# EAGLE board debug_backplane (EAGLE 8.3.1), part 1 of 3
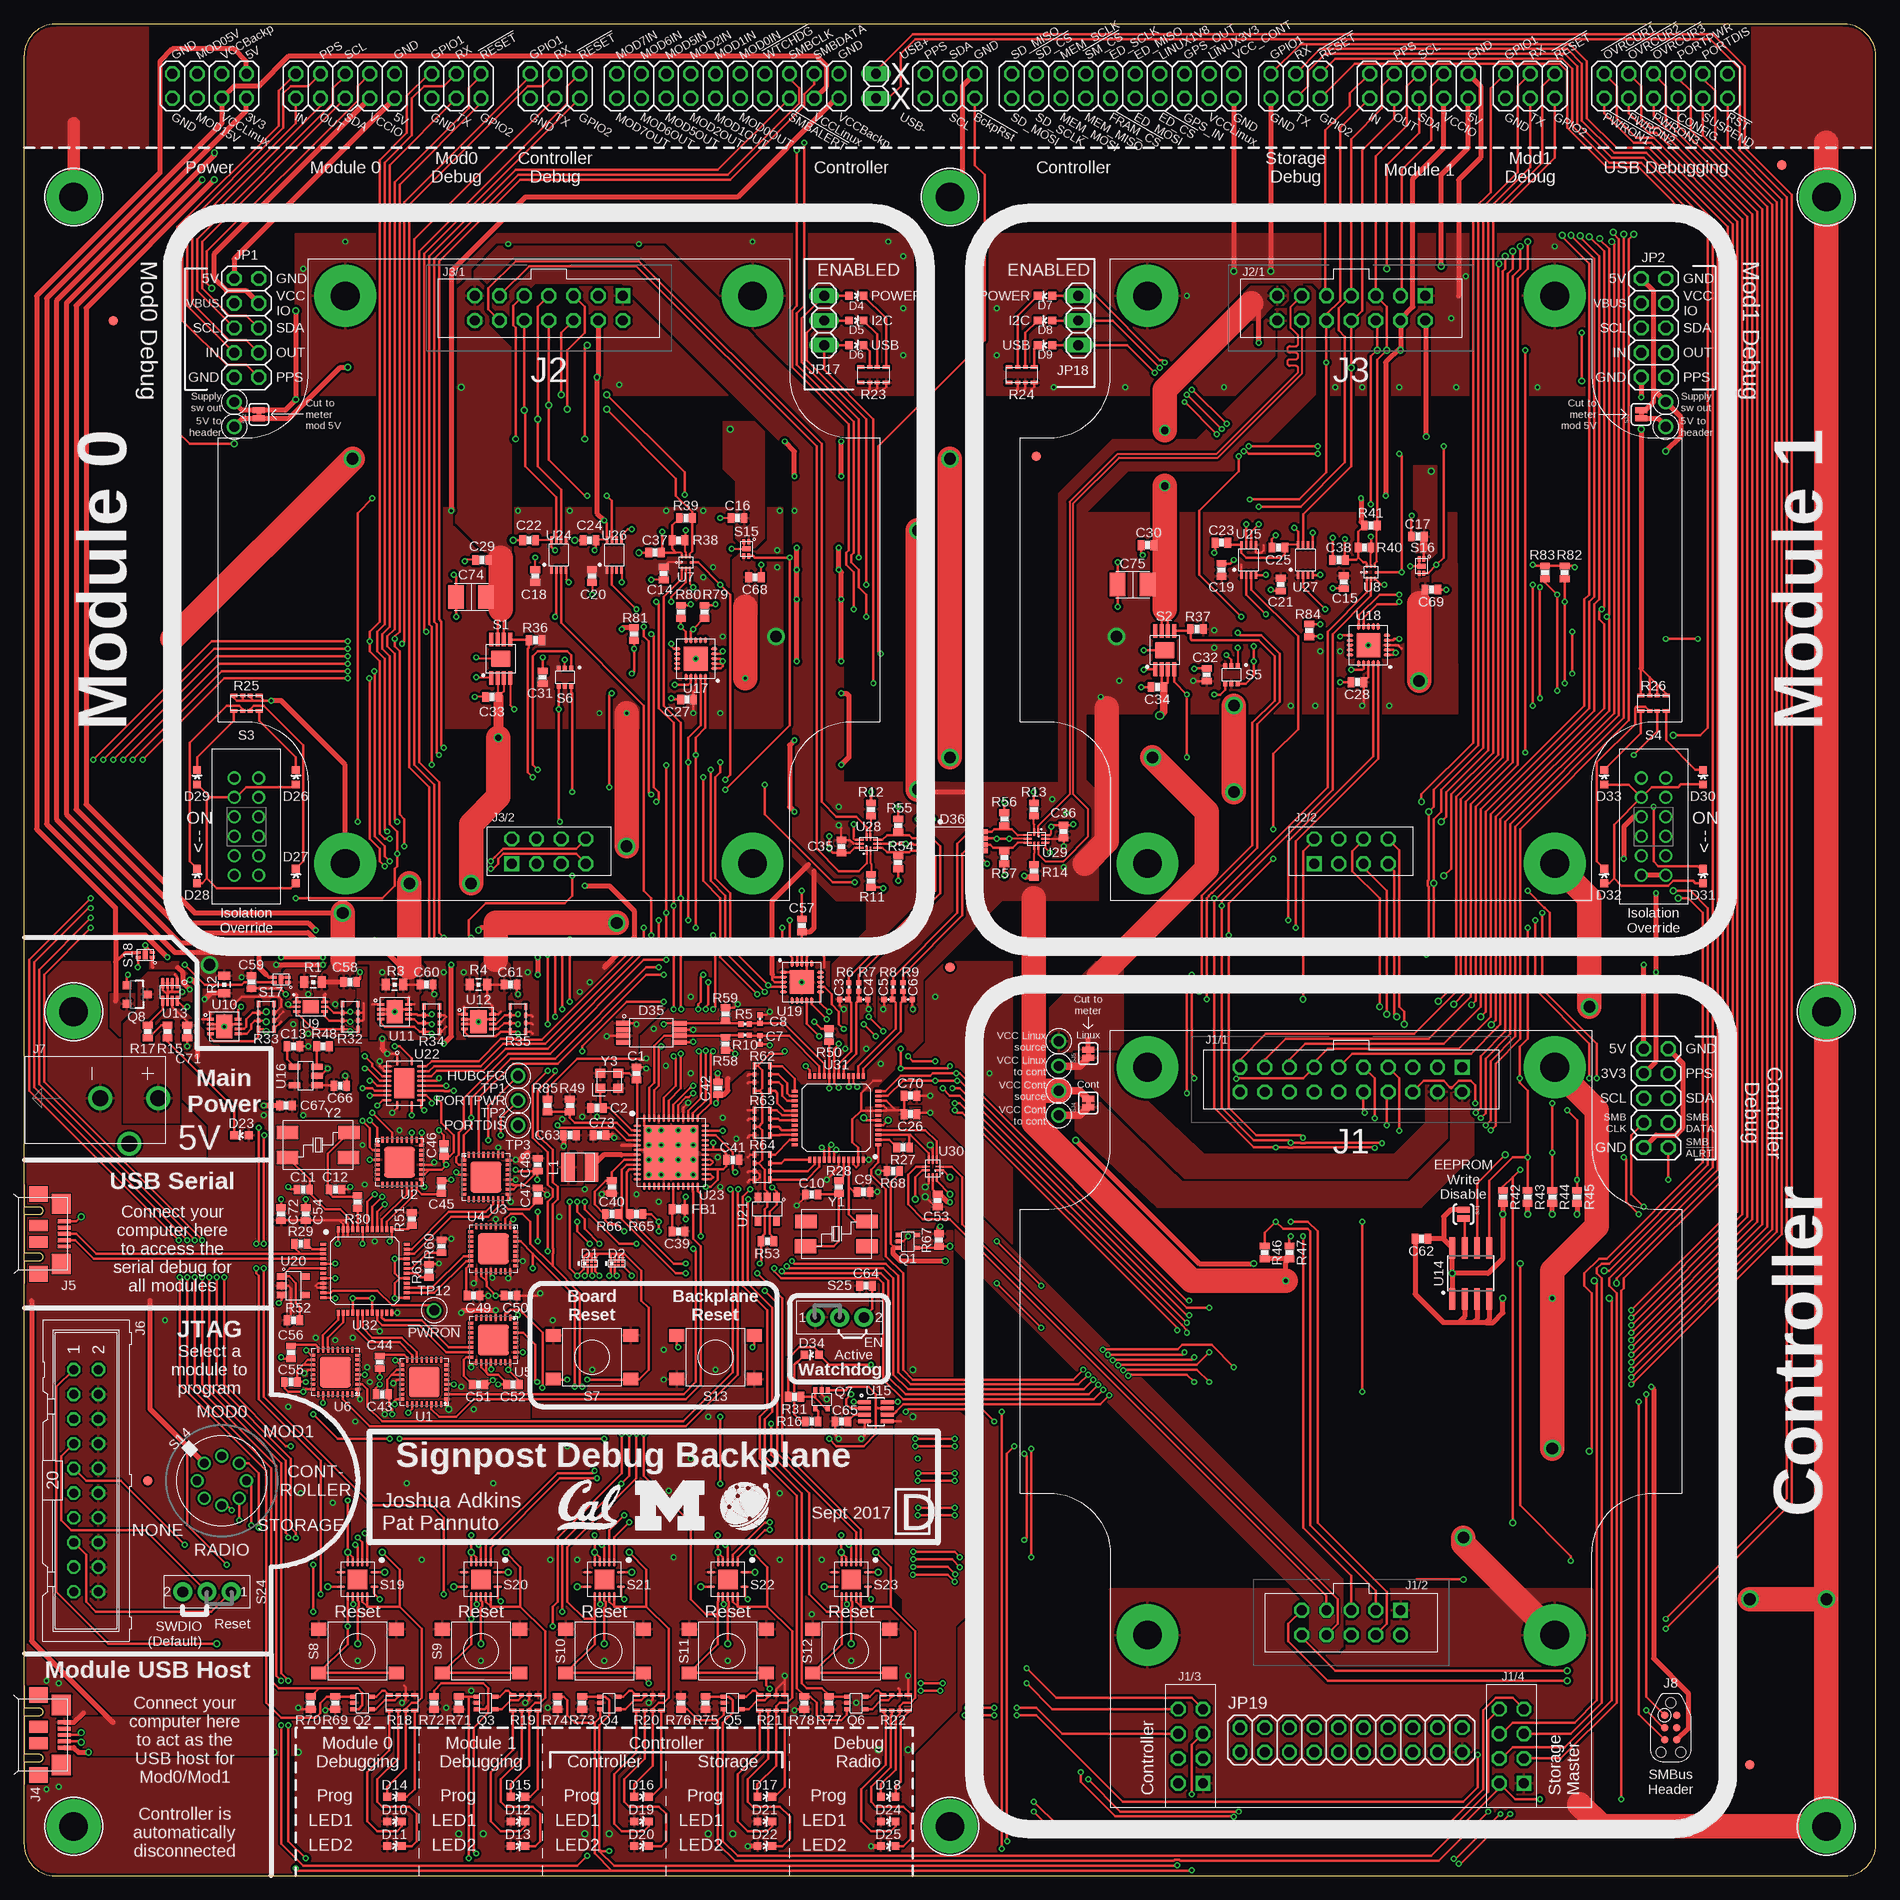
[diagram p18: board, top side]
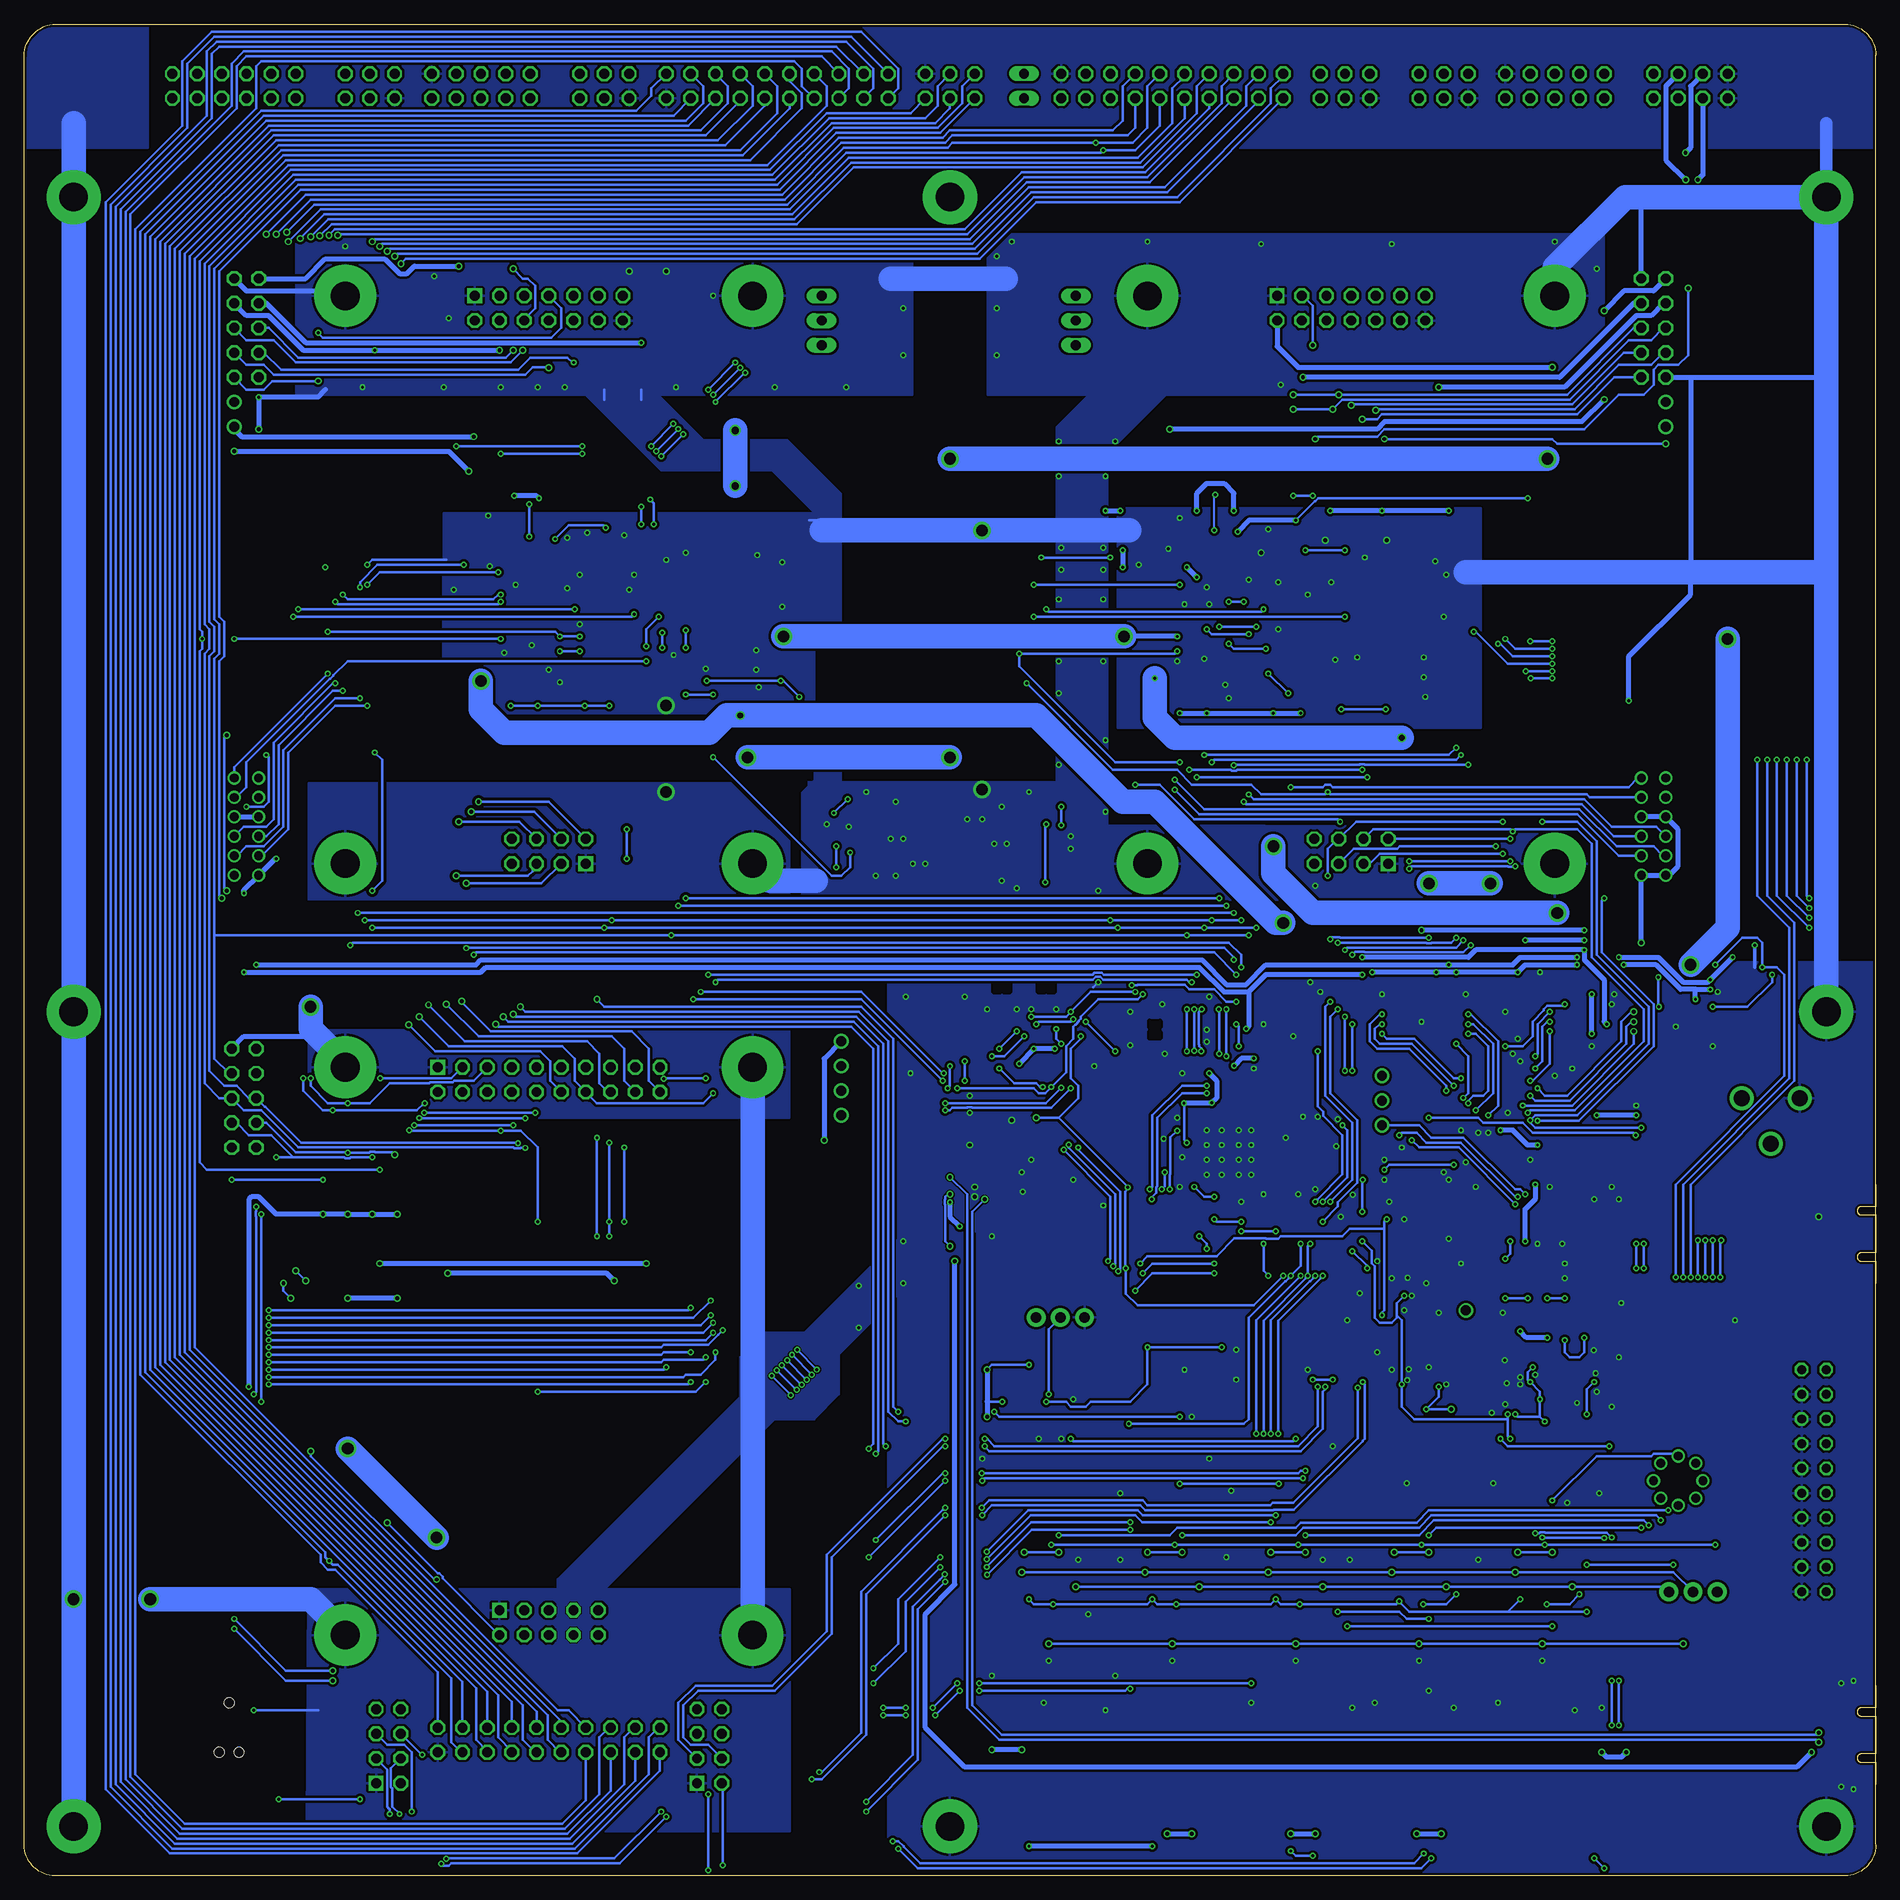
[diagram p19: board, bottom side, seen from below]

Size 190.5 x 190.5 mm. Coordinates in mm from the lower left corner, seen from the top.
Outline: 0,3.17 arc90 3.17,0 187.32,0 arc90 190.5,3.17 190.5,187.26 arc90 187.26,190.5 3.17,190.5 arc90 0,187.32 0,3.24
Copper layers (1*16): Top 0.035mm / dielectric 1.5mm / Bottom 0.035mm
Design rules "MF_Standard_2_Layer *": minimum track width 5mil, minimum drill 12mil, track to track 5mil, track to pad 5mil, pad to pad 5mil, via to via 5mil, smd to smd 0mil, copper to edge 10mil, drill to drill 10mil, minimum pad ring 6mil, minimum via ring 6mil, stop-mask expansion 2mil, vias tented up to drill 25mil, thermal gap 10mil
tRestrict: area 87.7,78.9 to 88,79; area 85.5,73.5 to 85.6,73.8; area 33,66.3 to 33.1,66.8

## Footprints (pad centres in the part's own frame; a part is rotated, then mirrored left to right if it is on the bottom)
0603_CAP = smd 0.7 x 1: 1 -0.65,0; 2 0.65,0
0402_CAP = smd 0.536 x 0.546: 1 -0.433,0; 2 0.433,0
1210_CAP = smd 2.4 x 1.6: 1 0,1.55; 2 0,-1.55
HMD8 = smd 0.25 x 0.3: 1A -0.6,-0.25; 1K -0.6,0.25; 2A -0.2,-0.25; 2K -0.2,0.25; 3A 0.2,-0.25; 3K 0.2,0.25; 4A 0.6,-0.25; 4K 0.6,0.25
LED-0603 = smd 0.8 x 0.8: A 0,-0.75; C 0,0.75
TSSOP-8 = smd 1.5 x 0.45: 1 -2.9,0.975; 2 -2.9,0.325; 3 -2.9,-0.325; 4 -2.9,-0.975; 5 2.9,-0.975; 6 2.9,-0.325; 7 2.9,0.325; 8 2.9,0.975
#4-PAD = drill 2.946 pad 5.563: B#4 0,0
BACKPLANE_MODULE_20PIN_10PIN_DEBUG = drill 1.016 square: 1 11.43,29.21; 21 5.08,-26.67; 100 -15.24,-44.45; 200 17.78,-44.45 | drill 1.016 octagon: 2 11.43,26.67; 3 8.89,29.21; 4 8.89,26.67; 5 6.35,29.21; 6 6.35,26.67; 7 3.81,29.21; 8 3.81,26.67; 9 1.27,29.21; 10 1.27,26.67; 11 -1.27,29.21; 12 -1.27,26.67; 13 -3.81,29.21; 14 -3.81,26.67; 15 -6.35,29.21; 16 -6.35,26.67; 17 -8.89,29.21; 18 -8.89,26.67; 19 -11.43,29.21; 20 -11.43,26.67; 22 5.08,-29.21; 23 2.54,-26.67; 24 2.54,-29.21; 25 0,-26.67; 26 0,-29.21; 27 -2.54,-26.67; 28 -2.54,-29.21; 29 -5.08,-26.67; 30 -5.08,-29.21; 101 -17.78,-44.45; 102 -15.24,-41.91; 103 -17.78,-41.91; 104 -15.24,-39.37; 105 -17.78,-39.37; 106 -15.24,-36.83; 107 -17.78,-36.83; 201 15.24,-44.45; 202 17.78,-41.91; 203 15.24,-41.91; 204 17.78,-39.37; 205 15.24,-39.37; 206 17.78,-36.83; 207 15.24,-36.83 | drill 2.946 pad 6.35: MNT1 -20.955,29.21; MNT2 20.955,29.21; MNT3 -20.955,-29.21; MNT4 20.955,-29.21
BACKPLANE_MODULE_14PIN_8PIN = drill 1.016 square: 1 7.62,29.21; 15 -3.81,-29.21 | drill 1.016 octagon: 2 7.62,26.67; 3 5.08,29.21; 4 5.08,26.67; 5 2.54,29.21; 6 2.54,26.67; 7 0,29.21; 8 0,26.67; 9 -2.54,29.21; 10 -2.54,26.67; 11 -5.08,29.21; 12 -5.08,26.67; 13 -7.62,29.21; 14 -7.62,26.67; 16 -3.81,-26.67; 17 -1.27,-29.21; 18 -1.27,-26.67; 19 1.27,-29.21; 20 1.27,-26.67; 21 3.81,-29.21; 22 3.81,-26.67 | drill 2.946 pad 6.35: MNT1 -20.955,29.21; MNT2 20.955,29.21; MNT3 20.955,-29.21; MNT4 -20.955,-29.21
USB_MICRO_B-HIROSE-ZX62R-B-5P = smd 0.4 x 1.35: 1 1.3,4.125; 2 0.65,4.125; 3 0,4.125; 4 -0.65,4.125; 5 -1.3,4.125 | smd 2.1 x 2: P$1 3.1,3.8; P$2 -3.1,3.8 | smd 1.6 x 1.9: P$3 -4.1,1.45; P$6 4.1,1.45 | smd 1.2 x 1.9: P$4 -0.85,1.45; P$5 0.85,1.45
ML20 = drill 0.914 octagon: 1 -11.43,-1.27; 2 -11.43,1.27; 3 -8.89,-1.27; 4 -8.89,1.27; 5 -6.35,-1.27; 6 -6.35,1.27; 7 -3.81,-1.27; 8 -3.81,1.27; 9 -1.27,-1.27; 10 -1.27,1.27; 11 1.27,-1.27; 12 1.27,1.27; 13 3.81,-1.27; 14 3.81,1.27; 15 6.35,-1.27; 16 6.35,1.27; 17 8.89,-1.27; 18 8.89,1.27; 19 11.43,-1.27; 20 11.43,1.27
PJ-102AH = drill 1.65: 1 0,-3; 2 0,3; 3 -4.7,0
TC2030-IDC-NL = smd 0.787 x 0.787: 1 -1.27,-0.635; 2 -1.27,0.635; 3 0,-0.635; 4 0,0.635; 5 1.27,-0.635; 6 1.27,0.635 | hole 1.016: -2.54,0; 2.54,-1.016; 2.54,1.016
2X05 = drill 1.016 octagon: 1 -5.08,-1.27; 2 -5.08,1.27; 3 -2.54,-1.27; 4 -2.54,1.27; 5 0,-1.27; 6 0,1.27; 7 2.54,-1.27; 8 2.54,1.27; 9 5.08,-1.27; 10 5.08,1.27
2X03 = drill 1.016 octagon: 1 -2.54,-1.27; 2 -2.54,1.27; 3 0,-1.27; 4 0,1.27; 5 2.54,-1.27; 6 2.54,1.27
2X10 = drill 1.016 octagon: 1 -11.43,-1.27; 2 -11.43,1.27; 3 -8.89,-1.27; 4 -8.89,1.27; 5 -6.35,-1.27; 6 -6.35,1.27; 7 -3.81,-1.27; 8 -3.81,1.27; 9 -1.27,-1.27; 10 -1.27,1.27; 11 1.27,-1.27; 12 1.27,1.27; 13 3.81,-1.27; 14 3.81,1.27; 15 6.35,-1.27; 16 6.35,1.27; 17 8.89,-1.27; 18 8.89,1.27; 19 11.43,-1.27; 20 11.43,1.27
1X02 = drill 1.016 long: 1 -1.27,0; 2 1.27,0
FIDUCIAL-1X2 = smd 1 x 1: 1 0,0
2X04 = drill 1.016 octagon: 1 -3.81,-1.27; 2 -3.81,1.27; 3 -1.27,-1.27; 4 -1.27,1.27; 5 1.27,-1.27; 6 1.27,1.27; 7 3.81,-1.27; 8 3.81,1.27
1X03 = drill 1.016 long: 1 -2.54,0; 2 0,0; 3 2.54,0
1212 = smd 1.4 x 3: P$1 -1.2,0; P$2 1.2,0
SOT353 = smd 0.42 x 0.6: D1 0.65,-0.95; D2 -0.65,-0.95; G1 0.65,0.95; G2 -0.65,0.95; S 0,0.95
SOT23-3 = smd 0.8 x 0.9: 1 -0.95,-1; 2 0.95,-1; 3 0,1.1
0805_RES = smd 0.8 x 1.2: 1 -0.9,0; 2 0.9,0
0402_RES-HIGH_SPEED = smd 0.536 x 0.546: 1 -0.433,0; 2 0.433,0
0603-RES = smd 0.7 x 1: 1 -0.65,0; 2 0.65,0
ARRAY-CONVEX-0603-4 = smd 0.7 x 0.35: A1 -1.3,0.8; A2 -1.3,-0.8; D1 1.3,0.8; D2 1.3,-0.8 | smd 0.5 x 0.35: B1 -0.4,0.8; B2 -0.4,-0.8; C1 0.4,0.8; C2 0.4,-0.8
MSOP-8EP = smd 0.45 x 1.35: 1 -0.975,-1.975; 2 -0.325,-1.975; 3 0.325,-1.975; 4 0.975,-1.975; 5 0.975,1.975; 6 0.325,1.975; 7 -0.325,1.975; 8 -0.975,1.975 | smd 2 x 1.7: PAD 0,0
MMS42 = drill 0.9: A1 -1.25,5; A2 1.25,5; A3 -1.25,-1; A4 1.25,-1; B1 -1.25,1; B2 1.25,1; B3 -1.25,-5; B4 1.25,-5; COM1 -1.25,3; COM2 1.25,3; COM3 -1.25,-3; COM4 1.25,-3
SC70-6 = smd 0.4 x 0.5: 1 -0.65,-0.95; 2 0,-0.95; 3 0.65,-0.95; 4 0.65,0.95; 5 0,0.95; 6 -0.65,0.95
PTS645 = smd 1.55 x 1.3: 1 -3.975,2.25; 2 3.975,2.25; 3 3.975,-2.25; 4 -3.975,-2.25
RM-SWITCH = drill 0.9: 1 1.796,1.796; 2 2.54,0; 3 1.796,-1.796; 4 0,-2.54; 5 -1.796,-1.796; 6 -2.54,0; 7 -1.796,1.796; C 0,2.54
TDFN4 = smd 0.3 x 0.55: 1 -0.25,-0.725; 2 0.25,-0.725; 3 0.25,0.725; 4 -0.25,0.725 | smd 0.86 x 0.5: PAD 0,0
S-PVQFN-N14-3.5MM = smd 0.85 x 0.28: 1 -1.725,-0.75; 7 1.725,-0.75; 8 1.725,0.75; 14 -1.725,0.75 | smd 0.28 x 0.85: 2 -1,-1.725; 3 -0.5,-1.725; 4 0,-1.725; 5 0.5,-1.725; 6 1,-1.725; 9 1,1.725; 10 0.5,1.725; 11 0,1.725; 12 -0.5,1.725; 13 -1,1.725 | smd 2 x 2: PAD 0,0
TE_SSA12/SPDT = drill 1.092 pad 1.93: 1 -2.489,0; 2 2.489,0; IN 0,0
SJ_2S-NO = smd 0.635 x 1.27: 1 -0.45,0; 2 0.45,0
SJ_2S = smd 0.635 x 1.27: 1 -0.412,0; 2 0.412,0
TESTPOINT_0.040IN = drill 1.016: TESTPOINT 0,0
QFN32 = smd 0.6 x 0.3: 1 -2.3,1.75; 2 -2.3,1.25; 3 -2.3,0.75; 4 -2.3,0.25; 5 -2.3,-0.25; 6 -2.3,-0.75; 7 -2.3,-1.25; 8 -2.3,-1.75; 17 2.3,-1.75; 18 2.3,-1.25; 19 2.3,-0.75; 20 2.3,-0.25; 21 2.3,0.25; 22 2.3,0.75; 23 2.3,1.25; 24 2.3,1.75 | smd 0.3 x 0.6: 9 -1.75,-2.3; 10 -1.25,-2.3; 11 -0.75,-2.3; 12 -0.25,-2.3; 13 0.25,-2.3; 14 0.75,-2.3; 15 1.25,-2.3; 16 1.75,-2.3; 25 1.75,2.3; 26 1.25,2.3; 27 0.75,2.3; 28 0.25,2.3; 29 -0.25,2.3; 30 -0.75,2.3; 31 -1.25,2.3; 32 -1.75,2.3 | smd 3.2 x 3.2: EXP 0,0
UMLP-8 = smd 0.35 x 0.25: 1 -0.55,0; 5 0.55,0 | smd 0.24 x 0.35: 2 -0.4,-0.625; 3 0,-0.625; 4 0.4,-0.625; 6 0.4,0.625; 7 0,0.625; 8 -0.4,0.625
DFN-6-2MMX3MM = smd 0.25 x 0.7: 1 -0.5,-1.425; 2 0,-1.425; 3 0.5,-1.425; 4 0.5,1.425; 5 0,1.425; 6 -0.5,1.425 | smd 1.35 x 1.65: NC 0,0
DFN-8 = smd 0.28 x 0.675: P1 -0.75,-1.42; P2 -0.25,-1.42; P3 0.25,-1.42; P4 0.75,-1.42; P5 0.75,1.42; P6 0.25,1.42; P7 -0.25,1.42; P8 -0.75,1.42 | smd 2.38 x 1.65: P$1 0,0
SC70-8 = smd 0.3 x 1: 1 -0.75,-0.9; 2 -0.25,-0.9; 3 0.25,-0.9; 4 0.75,-0.9; 5 0.75,0.9; 6 0.25,0.9; 7 -0.25,0.9; 8 -0.75,0.9
SOIC-8 = smd 0.61 x 2.21: 1 -1.905,-2.616; 2 -0.635,-2.616; 3 0.635,-2.616; 4 1.905,-2.616; 5 1.905,2.616; 6 0.635,2.616; 7 -0.635,2.616; 8 -1.905,2.616
SOT-23-8 = smd 0.42 x 1.3: 1 -0.975,-1.17; 2 -0.325,-1.17; 3 0.325,-1.17; 4 0.975,-1.17; 5 0.975,1.17; 6 0.325,1.17; 7 -0.325,1.17; 8 -0.975,1.17
SOT-23-5 = smd 0.6 x 1.2: 1 -0.95,-1.15; 2 0,-1.15; 3 0.95,-1.15; 4 0.95,1.15; 5 -0.95,1.15
QFN-20-4MM = smd 0.7 x 0.3: 1 -1.9,1; 2 -1.9,0.5; 3 -1.9,0; 4 -1.9,-0.5; 5 -1.9,-1; 11 1.9,-1; 12 1.9,-0.5; 13 1.9,0; 14 1.9,0.5; 15 1.9,1 | smd 0.3 x 0.7: 6 -1,-1.9; 7 -0.5,-1.9; 8 0,-1.9; 9 0.5,-1.9; 10 1,-1.9; 16 1,1.9; 17 0.5,1.9; 18 0,1.9; 19 -0.5,1.9; 20 -1,1.9 | smd 2.45 x 2.45: GND 0,0
SOT23-5 = smd 0.7 x 1: 1 0.95,1.2; 2 0,1.2; 3 -0.95,1.2; 4 -0.95,-1.2; 5 0.95,-1.2
QFN-N20 = smd 0.85 x 0.28: 1 -2.23,-0.75; 10 2.23,-0.75; 11 2.23,0.75; 20 -2.23,0.75 | smd 0.28 x 0.85: 2 -1.75,-1.73; 3 -1.25,-1.73; 4 -0.75,-1.73; 5 -0.25,-1.73; 6 0.25,-1.73; 7 0.75,-1.73; 8 1.25,-1.73; 9 1.75,-1.73; 12 1.75,1.73; 13 1.25,1.73; 14 0.75,1.73; 15 0.25,1.73; 16 -0.25,1.73; 17 -0.75,1.73; 18 -1.25,1.73; 19 -1.75,1.73 | smd 3.05 x 2.05: P$22 0,0
QFN-48-7MM = smd 0.8 x 0.28: 1 -3.5,2.75; 2 -3.5,2.25; 3 -3.5,1.75; 4 -3.5,1.25; 5 -3.5,0.75; 6 -3.5,0.25; 7 -3.5,-0.25; 8 -3.5,-0.75; 9 -3.5,-1.25; 10 -3.5,-1.75; 11 -3.5,-2.25; 12 -3.5,-2.75; 25 3.5,-2.75; 26 3.5,-2.25; 27 3.5,-1.75; 28 3.5,-1.25; 29 3.5,-0.75; 30 3.5,-0.25; 31 3.5,0.25; 32 3.5,0.75; 33 3.5,1.25; 34 3.5,1.75; 35 3.5,2.25; 36 3.5,2.75 | smd 0.28 x 0.8: 13 -2.75,-3.5; 14 -2.25,-3.5; 15 -1.75,-3.5; 16 -1.25,-3.5; 17 -0.75,-3.5; 18 -0.25,-3.5; 19 0.25,-3.5; 20 0.75,-3.5; 21 1.25,-3.5; 22 1.75,-3.5; 23 2.25,-3.5; 24 2.75,-3.5; 37 2.75,3.5; 38 2.25,3.5; 39 1.75,3.5; 40 1.25,3.5; 41 0.75,3.5; 42 0.25,3.5; 43 -0.25,3.5; 44 -0.75,3.5; 45 -1.25,3.5; 46 -1.75,3.5; 47 -2.25,3.5; 48 -2.75,3.5 | smd 5.6 x 5.6: THERMAL 0,0
VFSOP-8 = smd 0.25 x 0.75: 1 -0.75,-1.55; 2 -0.25,-1.55; 3 0.25,-1.55; 4 0.75,-1.55; 5 0.75,1.55; 6 0.25,1.55; 7 -0.25,1.55; 8 -0.75,1.55
UQFN-10 = smd 0.2 x 0.9: 1 -0.2,-0.65 | smd 0.2 x 0.8: 2 0.2,-0.7; 6 0.2,0.7; 7 -0.2,0.7 | smd 0.8 x 0.2: 3 0.9,-0.4; 4 0.9,0; 5 0.9,0.4; 8 -0.9,0.4; 9 -0.9,0; 10 -0.9,-0.4
LQFP-48 = smd 0.3 x 0.6: 1 -2.75,-4.3; 2 -2.25,-4.3; 3 -1.75,-4.3; 4 -1.25,-4.3; 5 -0.75,-4.3; 6 -0.25,-4.3; 7 0.25,-4.3; 8 0.75,-4.3; 9 1.25,-4.3; 10 1.75,-4.3; 11 2.25,-4.3; 12 2.75,-4.3; 25 2.75,4.3; 26 2.25,4.3; 27 1.75,4.3; 28 1.25,4.3; 29 0.75,4.3; 30 0.25,4.3; 31 -0.25,4.3; 32 -0.75,4.3; 33 -1.25,4.3; 34 -1.75,4.3; 35 -2.25,4.3; 36 -2.75,4.3 | smd 0.6 x 0.3: 13 4.3,-2.75; 14 4.3,-2.25; 15 4.3,-1.75; 16 4.3,-1.25; 17 4.3,-0.75; 18 4.3,-0.25; 19 4.3,0.25; 20 4.3,0.75; 21 4.3,1.25; 22 4.3,1.75; 23 4.3,2.25; 24 4.3,2.75; 37 -4.3,2.75; 38 -4.3,2.25; 39 -4.3,1.75; 40 -4.3,1.25; 41 -4.3,0.75; 42 -4.3,0.25; 43 -4.3,-0.25; 44 -4.3,-0.75; 45 -4.3,-1.25; 46 -4.3,-1.75; 47 -4.3,-2.25; 48 -4.3,-2.75
ABMM = smd 2.21 x 1.397: 1 -3.167,-1.27; 3 3.15,1.27; NC1 -3.15,1.27; NC2 3.15,-1.27
FHXXX = smd 1 x 0.95: 1 -0.925,-0.775; 2 0.925,-0.775; 3 0.925,0.775; 4 -0.925,0.775

## Placement (x,y rotation side)
C1  8pF  [0603_CAP]  62.99,82.55 90 top
C2  8pF  [0603_CAP]  58.93,78.99 180 top
C3  22pF  [0402_CAP]  84.33,90.17 180 top
C4  22pF  [0402_CAP]  86.36,90.17 0 top
C5  22pF  [0402_CAP]  88.9,90.17 180 top
C6  22pF  [0402_CAP]  90.93,90.17 0 top
C7  22pF  [0402_CAP]  75.69,85.98 270 top
C8  22pF  [0402_CAP]  75.69,88.14 90 top
C9  22pF  [0603_CAP]  86.36,70.36 180 top
C10  22pF  [0603_CAP]  81.03,70.1 0 top
C11  22pF  [0603_CAP]  28.7,70.61 0 top
C12  22pF  [0603_CAP]  32,70.61 180 top
C13  0.01uF  [0603_CAP]  27.69,85.34 0 top
C14  0.1uF  [0603_CAP]  65.79,133.99 270 top
C15  0.1uF  [0603_CAP]  135.76,133.1 270 top
C16  0.1uF  [0603_CAP]  73.41,139.7 180 top
C17  0.1uF  [0603_CAP]  143.38,137.79 180 top
C18  0.1uF  [0603_CAP]  52.58,133.73 90 top
C19  0.1uF  [0603_CAP]  123.19,134.37 90 top
C20  0.1uF  [0603_CAP]  58.42,133.73 270 top
C21  0.1uF  [0603_CAP]  129.29,132.84 270 top
C22  0.1uF  [0603_CAP]  51.94,137.41 180 top
C23  0.1uF  [0603_CAP]  123.19,137.16 180 top
C24  0.1uF  [0603_CAP]  58.17,137.41 180 top
C25  0.1uF  [0603_CAP]  129.03,136.65 180 top
C26  0.1uF  [0603_CAP]  91.19,78.36 180 top
C27  0.1uF  [0603_CAP]  68.2,121.03 180 top
C28  0.1uF  [0603_CAP]  137.16,122.81 180 top
C29  0.1uF  [0603_CAP]  47.12,135.38 180 top
C30  0.1uF  [0603_CAP]  115.57,136.91 180 top
C31  0.1uF  [0603_CAP]  53.34,123.32 90 top
C32  0.1uF  [0603_CAP]  121.67,123.57 90 top
C33  0.1uF  [0603_CAP]  48.13,121.28 180 top
C34  0.1uF  [0603_CAP]  116.59,122.3 180 top
C35  0.1uF  [0603_CAP]  84.07,105.92 90 top
C36  0.1uF  [0603_CAP]  106.93,107.44 270 top
C37  0.1uF  [0603_CAP]  64.9,136.14 180 top
C38  0.1uF  [0603_CAP]  135.25,135.38 180 top
C39  0.1uF  [0603_CAP]  67.31,66.29 0 top
C40  0.1uF  [0603_CAP]  60.45,70.87 270 top
C41  0.1uF  [0603_CAP]  72.9,73.66 0 top
C42  0.1uF  [0603_CAP]  71.37,81.03 90 top
C43  0.1uF  [0603_CAP]  36.83,49.53 180 top
C44  0.1uF  [0603_CAP]  36.58,52.83 270 top
C45  0.1uF  [0603_CAP]  42.93,70.87 90 top
C46  0.1uF  [0603_CAP]  43.18,74.68 90 top
C47  0.1uF  [0603_CAP]  52.83,70.1 90 top
C48  0.1uF  [0603_CAP]  52.83,73.15 90 top
C49  0.1uF  [0603_CAP]  46.23,59.69 0 top
C50  0.1uF  [0603_CAP]  50.04,59.69 0 top
C51  0.1uF  [0603_CAP]  46.74,50.55 0 top
C52  0.1uF  [0603_CAP]  50.29,50.55 0 top
C53  0.1uF  [0603_CAP]  93.98,69.47 90 top
C54  0.1uF  [0603_CAP]  28.96,68.07 270 top
C55  0.1uF  [0603_CAP]  27.43,50.8 180 top
C56  0.1uF  [0603_CAP]  27.43,53.85 270 top
C57  0.1uF  [0603_CAP]  80.01,97.79 90 top
C58  0.1uF  [0603_CAP]  33.53,91.95 0 top
C59  0.1uF  [0603_CAP]  23.37,91.95 270 top
C60  0.1uF  [0603_CAP]  41.4,91.69 0 top
C61  0.1uF  [0603_CAP]  50.04,91.69 0 top
C62  0.1uF  [0603_CAP]  143.76,65.53 180 top
C63  0.1uF  [0603_CAP]  56.13,76.2 180 top
C64  0.47uF  [0603_CAP]  86.61,60.71 180 top
C65  0.82uF  [0603_CAP]  84.07,46.74 180 top
C66  2.2uF  [0603_CAP]  32.51,81.28 0 top
C67  2.2uF  [0603_CAP]  26.92,79.25 180 top
C68  4.7uF  [0603_CAP]  75.18,133.6 0 top
C69  4.7uF  [0603_CAP]  144.78,132.33 0 top
C70  4.7uF  [0603_CAP]  91.19,80.26 180 top
C71  4.7uF  [0603_CAP]  16.76,86.87 270 top
C72  4.7uF  [0603_CAP]  26.42,68.07 270 top
C73  6.8uF  [0603_CAP]  59.18,76.2 0 top
C74  150uF  [1210_CAP]  45.97,131.57 270 top
C75  150uF  [1210_CAP]  114.05,132.84 270 top
D1  DIODE_SCHOTTKY_ARRAY-4HMD8  [HMD8]  58.17,62.99 0 top
D2  DIODE_SCHOTTKY_ARRAY-4HMD8  [HMD8]  60.96,62.99 0 top
D4  LED0603  [LED-0603]  85.6,162.56 270 top
D5  LED0603  [LED-0603]  85.6,160.02 270 top
D6  LED0603  [LED-0603]  85.6,157.48 270 top
D7  LED0603  [LED-0603]  105.03,162.56 90 top
D8  LED0603  [LED-0603]  105.03,160.02 90 top
D9  LED0603  [LED-0603]  105.03,157.48 90 top
D10  LED0603  [LED-0603]  38.1,5.59 270 top
D11  LED0603  [LED-0603]  38.1,3.05 270 top
D12  LED0603  [LED-0603]  50.8,5.59 270 top
D13  LED0603  [LED-0603]  50.8,3.05 270 top
D14  LED0603  [LED-0603]  38.1,8.13 270 top
D15  LED0603  [LED-0603]  50.8,8.13 270 top
D16  LED0603  [LED-0603]  63.5,8.13 270 top
D17  LED0603  [LED-0603]  76.2,8.13 270 top
D18  LED0603  [LED-0603]  88.9,8.13 270 top
D19  LED0603  [LED-0603]  63.5,5.59 270 top
D20  LED0603  [LED-0603]  63.5,3.05 270 top
D21  LED0603  [LED-0603]  76.2,5.59 270 top
D22  LED0603  [LED-0603]  76.2,3.05 270 top
D23  LED0603  [LED-0603]  22.35,76.2 90 top
D24  LED0603  [LED-0603]  88.9,5.59 270 top
D25  LED0603  [LED-0603]  88.9,3.05 270 top
D26  LED0603  [LED-0603]  27.94,113.03 0 top
D27  LED0603  [LED-0603]  27.94,102.87 0 top
D28  LED0603  [LED-0603]  17.78,102.87 0 top
D29  LED0603  [LED-0603]  17.78,113.03 0 top
D30  LED0603  [LED-0603]  172.72,113.03 0 top
D31  LED0603  [LED-0603]  172.72,102.87 0 top
D32  LED0603  [LED-0603]  162.56,102.87 0 top
D33  LED0603  [LED-0603]  162.56,113.03 0 top
D34  LED0603  [LED-0603]  81.03,53.59 90 top
D35  SN75240-TSSOP  [TSSOP-8]  64.52,86.74 0 top
D36  SN75240-TSSOP  [TSSOP-8]  95.5,106.43 0 top
FB1  1.5kR  [0603_CAP]  67.31,68.58 0 top
H1  MOUNT-PAD-ROUND#4  [#4-PAD]  5.08,172.72 0 top
H2  MOUNT-PAD-ROUND#4  [#4-PAD]  95.25,172.72 0 top
H3  MOUNT-PAD-ROUND#4  [#4-PAD]  185.42,172.72 0 top
H4  MOUNT-PAD-ROUND#4  [#4-PAD]  5.08,88.9 0 top
H5  MOUNT-PAD-ROUND#4  [#4-PAD]  185.42,88.9 0 top
H6  MOUNT-PAD-ROUND#4  [#4-PAD]  5.08,5.08 0 top
H7  MOUNT-PAD-ROUND#4  [#4-PAD]  95.25,5.08 0 top
H8  MOUNT-PAD-ROUND#4  [#4-PAD]  185.42,5.08 0 top
J1  BACKPLANE_CONTROLLER_MODULE_DEBUG  [BACKPLANE_MODULE_20PIN_10PIN_DEBUG]  136.53,53.98 0 top
J2  BACKPLANE_GENERIC_MODULE_DEBUG  [BACKPLANE_MODULE_14PIN_8PIN]  53.98,133.35 0 top
J3  BACKPLANE_GENERIC_MODULE_DEBUG  [BACKPLANE_MODULE_14PIN_8PIN]  136.53,133.35 0 top
J4  MICRO_USB_B_HIROSE_ZX62R-B-5P  [USB_MICRO_B-HIROSE-ZX62R-B-5P]  0,14.48 270 top
J5  MICRO_USB_B_HIROSE_ZX62R-B-5P  [USB_MICRO_B-HIROSE-ZX62R-B-5P]  0,66.04 270 top
J6  [ML20]  6.35,40.64 270 top
J7  PJ-102AH  [PJ-102AH]  10.79,80.01 90 top
J8  TC2030-FTDI-I2C  [TC2030-IDC-NL]  169.42,15.24 270 top
JP1  [2X05]  22.86,159.26 270 top
JP2  [2X05]  167.64,159.26 270 top
JP3  [2X03]  44.45,184.15 180 top
JP4  [2X05]  33.02,184.15 180 top
JP5  [2X05]  143.51,184.15 180 top
JP6  [2X03]  154.94,184.15 180 top
JP7  [2X03]  172.72,184.15 0 top
JP8  [2X03]  165.1,184.15 0 top
JP9  [2X03]  54.61,184.15 180 top
JP10  [2X03]  130.81,184.15 180 top
JP11  [2X05]  167.89,80.01 270 top
JP12  [2X10]  72.39,184.15 180 top
JP13  [1X02]  87.63,184.15 270 top
JP14  [2X03]  95.25,184.15 180 top
JP15  FIDUCIAL1X2  [FIDUCIAL-1X2]  177.55,11.43 0 top
JP16  [2X04]  19.05,184.15 180 top
JP17  [1X03]  82.3,160.02 90 top
JP18  [1X03]  108.46,160.02 90 top
JP19  [2X10]  136.53,13.97 0 top
JP20  [2X10]  113.03,184.15 0 top
JP21  FIDUCIAL1X2  [FIDUCIAL-1X2]  95.25,93.47 0 top
JP22  FIDUCIAL1X2  [FIDUCIAL-1X2]  12.7,40.64 0 top
JP23  FIDUCIAL1X2  [FIDUCIAL-1X2]  9.14,160.02 0 top
JP24  FIDUCIAL1X2  [FIDUCIAL-1X2]  180.85,176.02 0 top
JP25  FIDUCIAL1X2  [FIDUCIAL-1X2]  104.14,146.05 0 top
L1  22uH  [1212]  57.15,72.9 180 top
Q1  DMN32D2LDF  [SOT353]  90.93,65.28 90 top
Q2  DMN32D2LDF  [SOT353]  34.8,17.78 90 top
Q3  DMN32D2LDF  [SOT353]  47.5,17.78 90 top
Q4  DMN32D2LDF  [SOT353]  60.2,17.78 90 top
Q5  DMN32D2LDF  [SOT353]  72.9,17.78 90 top
Q6  DMN32D2LDF  [SOT353]  85.6,17.78 90 top
Q7  DMN32D2LDF  [SOT353]  82.04,49.02 0 top
Q8  MOSFET-NCHANNELSMD  [SOT23-3]  11.56,90.68 270 top
R1  0.017Ω  [0805_RES]  29.72,91.95 180 top
R2  0.017Ω  [0805_RES]  20.57,91.69 270 top
R3  0.017Ω  [0805_RES]  38.1,91.69 180 top
R4  0.017Ω  [0805_RES]  46.74,91.69 180 top
R5  27Ω  [0402_RES-HIGH_SPEED]  74.17,87.63 0 top
R6  27Ω  [0402_RES-HIGH_SPEED]  84.84,91.44 270 top
R7  27Ω  [0402_RES-HIGH_SPEED]  85.85,91.44 270 top
R8  27Ω  [0402_RES-HIGH_SPEED]  89.41,91.44 270 top
R9  27Ω  [0402_RES-HIGH_SPEED]  90.42,91.44 270 top
R10  27Ω  [0402_RES-HIGH_SPEED]  74.17,86.49 0 top
R11  50Ω  [0603-RES]  87.12,102.36 270 top
R12  50Ω  [0603-RES]  87.12,109.73 90 top
R13  50Ω  [0603-RES]  103.89,109.73 90 top
R14  50Ω  [0603-RES]  103.89,103.38 270 top
R15  50Ω  [0603-RES]  14.73,86.87 270 top
R16  50Ω  [0603-RES]  81.03,46.74 180 top
R17  50Ω  [0603-RES]  12.7,86.87 270 top
R18  1kΩ  [ARRAY-CONVEX-0603-4]  38.86,17.78 0 top
R19  1kΩ  [ARRAY-CONVEX-0603-4]  51.56,17.78 0 top
R20  1kΩ  [ARRAY-CONVEX-0603-4]  64.26,17.78 0 top
R21  1kΩ  [ARRAY-CONVEX-0603-4]  76.96,17.78 0 top
R22  1kΩ  [ARRAY-CONVEX-0603-4]  89.66,17.78 0 top
R23  1kΩ  [ARRAY-CONVEX-0603-4]  87.38,154.43 180 top
R24  1kΩ  [ARRAY-CONVEX-0603-4]  102.62,154.43 180 top
R25  1kΩ  [ARRAY-CONVEX-0603-4]  22.86,120.65 180 top
R26  1kΩ  [ARRAY-CONVEX-0603-4]  167.64,120.65 180 top
R27  1.5kΩ  [0603-RES]  90.42,74.93 180 top
R28  1.5kΩ  [0603-RES]  83.82,70.87 90 top
R29  1.5kΩ  [0603-RES]  28.45,65.02 0 top
R30  1.5kΩ  [0603-RES]  34.29,69.34 270 top
R31  1.5kΩ  [0603-RES]  79.25,49.28 180 top
R32  1.8kΩ  [ARRAY-CONVEX-0603-4]  33.53,88.39 90 top
R33  1.8kΩ  [ARRAY-CONVEX-0603-4]  24.89,88.39 90 top
R34  1.8kΩ  [ARRAY-CONVEX-0603-4]  41.91,88.14 90 top
R35  1.8kΩ  [ARRAY-CONVEX-0603-4]  50.8,88.14 90 top
R36  10kΩ  [0603-RES]  52.58,127.13 0 top
R37  10kΩ  [0603-RES]  120.65,128.27 0 top
R38  10kΩ  [0603-RES]  67.31,137.41 0 top
R39  10kΩ  [0603-RES]  68.07,139.7 0 top
R40  10kΩ  [0603-RES]  137.92,136.65 0 top
R41  10kΩ  [0603-RES]  138.56,138.94 0 top
R42  10kΩ  [0603-RES]  152.15,69.85 270 top
R43  10kΩ  [0603-RES]  154.69,69.85 270 top
R44  10kΩ  [0603-RES]  157.23,69.85 270 top
R45  10kΩ  [0603-RES]  159.77,69.85 270 top
R46  10kΩ  [0603-RES]  127.64,64.14 270 top
R47  10kΩ  [0603-RES]  130.18,64.14 270 top
R48  10kΩ  [0603-RES]  30.73,85.34 0 top
R49  10kΩ  [0603-RES]  56.13,79.25 270 top
R50  10kΩ  [0603-RES]  82.8,86.49 90 top
R51  10kΩ  [0603-RES]  39.88,67.56 90 top
R52  10kΩ  [0603-RES]  27.69,57.15 180 top
R53  10kΩ  [0603-RES]  76.45,65.28 180 top
R54  15kΩ  [0603-RES]  89.92,104.27 90 top
R55  15kΩ  [0603-RES]  89.92,108.08 270 top
R56  15kΩ  [0603-RES]  100.84,108.71 270 top
R57  15kΩ  [0603-RES]  100.84,104.78 90 top
R58  15kΩ  [0603-RES]  72.14,85.6 90 top
R59  15kΩ  [0603-RES]  72.14,88.65 270 top
R60  15kΩ  [0603-RES]  42.93,64.77 90 top
R61  15kΩ  [0603-RES]  41.66,62.23 90 top
R62  15kΩ  [ARRAY-CONVEX-0603-4]  75.95,82.04 270 top
R63  15kΩ  [ARRAY-CONVEX-0603-4]  75.95,77.47 270 top
R64  15kΩ  [ARRAY-CONVEX-0603-4]  75.95,72.9 270 top
R65  100kΩ  [0603-RES]  62.99,68.07 0 top
R66  100kΩ  [0603-RES]  60.45,68.07 180 top
R67  100kΩ  [0603-RES]  94.11,65.41 90 top
R68  100kΩ  [0603-RES]  89.41,72.52 0 top
R69  1MΩ  [0603-RES]  32,17.78 90 top
R70  1MΩ  [0603-RES]  29.46,17.78 90 top
R71  1MΩ  [0603-RES]  44.7,17.78 90 top
R72  1MΩ  [0603-RES]  42.16,17.78 90 top
R73  1MΩ  [0603-RES]  57.4,17.78 90 top
R74  1MΩ  [0603-RES]  54.86,17.78 90 top
R75  1MΩ  [0603-RES]  70.1,17.78 90 top
R76  1MΩ  [0603-RES]  67.56,17.78 270 top
R77  1MΩ  [0603-RES]  82.8,17.78 90 top
R78  1MΩ  [0603-RES]  80.26,17.78 90 top
R79  10MΩ  [0603-RES]  69.98,130.05 270 top
R80  10MΩ  [0603-RES]  67.56,130.05 270 top
R81  10MΩ  [0603-RES]  62.74,127.76 270 top
R82  10MΩ  [0603-RES]  158.5,134.11 270 top
R83  10MΩ  [0603-RES]  156.46,134.11 270 top
R84  10MΩ  [0603-RES]  132.21,128.14 270 top
R85  DNP  [0603-RES]  53.85,79.25 90 top
S1  AP2401MP  [MSOP-8EP]  49.02,125.22 0 top
S2  AP2401MP  [MSOP-8EP]  117.35,126.11 0 top
S3  MMS42  [MMS42]  22.86,107.95 0 top
S4  MMS42  [MMS42]  167.64,107.95 0 top
S5  NC7SZ157  [SC70-6]  124.21,123.57 180 top
S6  NC7SZ157  [SC70-6]  55.63,123.32 180 top
S7  PTS645SM43SMTR92  [PTS645]  58.42,53.34 180 top
S8  PTS645SM43SMTR92  [PTS645]  34.29,23.11 0 top
S9  PTS645SM43SMTR92  [PTS645]  46.99,23.11 0 top
S10  PTS645SM43SMTR92  [PTS645]  59.69,23.11 0 top
S11  PTS645SM43SMTR92  [PTS645]  72.39,23.11 0 top
S12  PTS645SM43SMTR92  [PTS645]  85.09,23.11 0 top
S13  PTS645SM43SMTR92  [PTS645]  71.12,53.34 180 top
S14  RM106772BCB  [RM-SWITCH]  20.32,40.64 45 top
S15  SIP3240X  [TDFN4]  74.3,136.53 180 top
S16  SIP3240X  [TDFN4]  143.76,134.75 180 top
S17  SIP3240X  [TDFN4]  26.42,92.2 90 top
S18  SIP3240X  [TDFN4]  12.45,94.74 90 top
S19  SN74AHC4066-RGY  [S-PVQFN-N14-3.5MM]  34.29,30.48 180 top
S20  SN74AHC4066-RGY  [S-PVQFN-N14-3.5MM]  46.99,30.48 180 top
S21  SN74AHC4066-RGY  [S-PVQFN-N14-3.5MM]  59.69,30.48 180 top
S22  SN74AHC4066-RGY  [S-PVQFN-N14-3.5MM]  72.39,30.48 180 top
S23  SN74AHC4066-RGY  [S-PVQFN-N14-3.5MM]  85.09,30.48 180 top
S24  TE_SSA12/SPDT  [TE_SSA12/SPDT]  18.8,29.21 180 top
S25  TE_SSA12/SPDT  [TE_SSA12/SPDT]  83.9,57.44 0 top
SJ1  SOLDERJUMPERNO  [SJ_2S-NO]  148.08,68.07 270 top
SJ2  SOLDERJUMPERNC  [SJ_2S]  24.13,150.37 90 top
SJ3  SOLDERJUMPERNC  [SJ_2S]  166.37,150.37 90 top
SJ4  SOLDERJUMPERNC  [SJ_2S]  109.47,79.5 90 top
SJ5  SOLDERJUMPERNC  [SJ_2S]  109.47,84.58 90 top
TP1  TEST_POINT_0.040IN  [TESTPOINT_0.040IN]  50.8,82.3 0 top
TP2  TEST_POINT_0.040IN  [TESTPOINT_0.040IN]  50.8,79.76 0 top
TP3  TEST_POINT_0.040IN  [TESTPOINT_0.040IN]  50.8,77.22 0 top
TP4  TEST_POINT_0.040IN  [TESTPOINT_0.040IN]  21.59,149.1 0 top
TP5  TEST_POINT_0.040IN  [TESTPOINT_0.040IN]  21.59,151.64 0 top
TP6  TEST_POINT_0.040IN  [TESTPOINT_0.040IN]  168.91,149.1 0 top
TP7  TEST_POINT_0.040IN  [TESTPOINT_0.040IN]  168.91,151.64 0 top
TP8  TEST_POINT_0.040IN  [TESTPOINT_0.040IN]  106.43,78.23 0 top
TP9  TEST_POINT_0.040IN  [TESTPOINT_0.040IN]  106.43,80.77 0 top
TP10  TEST_POINT_0.040IN  [TESTPOINT_0.040IN]  106.43,83.31 0 top
TP11  TEST_POINT_0.040IN  [TESTPOINT_0.040IN]  106.43,85.85 0 top
TP12  TEST_POINT_0.040IN  [TESTPOINT_0.040IN]  42.16,58.17 0 top
U1  FT232RQ  [QFN32]  41.15,50.8 180 top
U2  FT232RQ  [QFN32]  38.61,73.41 0 top
U3  FT232RQ  [QFN32]  47.5,71.88 0 top
U4  FT232RQ  [QFN32]  48.26,64.52 270 top
U5  FT232RQ  [QFN32]  48.26,55.12 270 top
U6  FT232RQ  [QFN32]  32,51.82 180 top
U7  FXMA2102  [UMLP-8]  68.07,135.13 0 top
U8  FXMA2102  [UMLP-8]  138.56,134.11 0 top
U9  LTC2941  [DFN-6-2MMX3MM]  29.46,89.41 270 top
U10  LTC2943  [DFN-8]  20.57,87.38 270 top
U11  LTC2943  [DFN-8]  38.1,88.9 270 top
U12  LTC2943  [DFN-8]  46.74,87.88 270 top
U13  LTC4360  [SC70-8]  14.99,90.93 180 top
U14  M24C01WMN  [SOIC-8]  148.84,61.98 0 top
U15  MAX6746  [SOT-23-8]  87.63,47.75 270 top
U16  MAX8887EZK33+T  [SOT-23-5]  28.96,82.3 90 top
U17  MCP23008QFN  [QFN-20-4MM]  69.09,125.22 180 top
U18  MCP23008QFN  [QFN-20-4MM]  138.3,126.62 180 top
U19  MCP23008QFN  [QFN-20-4MM]  80.01,91.95 0 top
U20  NCP301LSN30  [SOT23-5]  27.69,60.71 90 top
U21  NCP301LSN30  [SOT23-5]  76.45,68.58 0 top
U22  PCA9544AQFN-N20  [QFN-N20]  39.12,81.53 270 top
U23  SAM4LC8AA  [QFN-48-7MM]  66.55,74.42 0 top
U24  SN74LVC2T45  [VFSOP-8]  54.99,135.89 0 top
U25  SN74LVC2T45  [VFSOP-8]  125.98,135.38 0 top
U26  SN74LVC2T45  [VFSOP-8]  60.71,135.89 0 top
U27  SN74LVC2T45  [VFSOP-8]  131.83,135.38 0 top
U28  TS3USB30E  [UQFN-10]  86.87,106.17 0 top
U29  TS3USB30E  [UQFN-10]  104.14,106.68 180 top
U30  TS3USB30E  [UQFN-10]  93.47,72.77 90 top
U31  TUSB2077A  [LQFP-48]  83.57,77.98 90 top
U32  TUSB2077A  [LQFP-48]  35.05,62.23 270 top
U$12  [UMICH_SOLID_200MIL]  62.87,35.56 0 top
U$15  [UCB_CAL_200MIL]  54.86,35.56 0 top
U$28  [TERRASWARM_200MIL]  71.63,35.56 0 top
Y1  ABMM  [ABMM]  83.57,66.04 0 top
Y2  ABMM  [ABMM]  30.23,75.18 180 top
Y3  FH1600015  [FHXXX]  60.2,81.79 0 top

## Tracks (layer width: path | path; a pad name or v marks a point on that pad's centre or on a via)
3V3_UNMETERED  (via drill 0.3, 0.41)
  Top 0.203: U23.31 | 70.08,72.64 U23.27
  Top 0.254: 16.51,44.45 16.76,44.2 16.76,36.07 v20.83,32 | C72.2 C54.2 32.4,67.42 | U20.2 27.18,60.71 27.43,60.45 27.43,57.55 R52.2 | v29.72,27.18 v29.72,32 | U32.10 30.2,60.48 29.97,60.71 30.25,60.98 U32.9 | 32.4,67.42 32.8,67.02 U32.47 | 32.4,67.42 32.91,67.42 33.3,67.03 U32.46 33.3,65.81 33.27,65.79 | U32.47 32.79,65.81 | v34.54,49.02 34.3,49.26 U6.1 | v36.58,28.45 36.02,29.01 S19.14 | v43.69,48.01 43.45,48.25 U1.1 | v49.02,28.25 48.72,28.55 S20.14 | R85.2 53.85,81.03 56.9,84.07 64.01,84.07 | v59.25,27.94 59.19,28 S21.10 | v61.72,66.29 60.96,67.06 60.2,67.06 59.8,67.45 R66.2 59.69,68.07 58.67,69.09 58.67,70.36 59.83,71.52 C40.1 60.45,72.39 61.73,73.67 U23.8 | v61.72,28.45 61.41,28.75 S21.14 | R65.2 64.52,68.07 v65.28,67.31 v65.28,66.29 | U23.40 67.8,79 v68.31,79.52 | v68.07,67.56 67.96,67.68 FB1.2 67.96,69.74 v68.07,69.85 | v70.1,70.87 70.61,70.87 71.37,71.63 71.37,72.67 | 70.87,74.67 U23.31 | 70.87,74.67 71.89,74.67 72.25,74.31 C41.1 72.25,73.01 71.91,72.67 71.37,72.67 | 70.87,74.67 70.87,74.68 v70.87,75.43 | 71.37,72.67 U23.27 | v71.17,79.5 71.37,79.7 C42.1 | v71.95,27.94 71.89,28 S22.10 | v74.42,28.45 74.11,28.75 S22.14 | v87.12,52.58 82.8,52.58 D34.A 81.78,53.86 81.28,54.36 79.76,54.36 78.6,53.2 R31.2 | v84.65,27.94 84.59,28 S23.10 | v87.12,28.45 86.81,28.75 S23.14 | U15.5 90.13,46.78 90.17,46.74 | U15.8 89.82,48.73 v89.86,48.77 | C53.2 93.47,70.63 U30.9
  Top 0.381: S17.3 25.15,92.45 24.89,92.71
  Top 0.508: 9.14,15.75 0.76,24.13 0.76,59.18 | 12.95,59.18 12.95,48.01 16.51,44.45 S14.C | v24.13,96.01 16,96.01 3.3,108.71 3.3,162.05 22.86,181.61 JP16.2 | v164.59,104.65 164.59,107.95 165.59,108.95 S4.B1 | JP11.3 167.89,83.82 v167.89,92.96 v167.89,101.09 | S4.B4 S4.B3 | S14.C | v52.83,94.49 v52.83,92.71 | C42.1 71.99,80.38 72.39,80.77 72.39,82.04 | D22.A v74.42,3.05 | v87.12,3.05 D25.A | C53.2 94.19,70.12 94.94,69.37 95.2,69.37 v95.25,69.32 | R67.2 94.11,66.67 v94.23,66.8 | v29.97,95.25 29.21,96.01 v24.13,96.01 | v24.13,96.01 24.13,93.47 24.89,92.71
  Bottom 0.254: v29.72,32 v20.83,32 | v29.97,55.37 29.97,53.85 30.48,53.34 31.5,53.34 32,53.85 v32,55.12 | 34.54,47.24 v34.04,46.74 | 34.54,47.24 v34.54,49.02 34.54,49.78 v35.56,50.8 35.81,51.05 35.81,51.82 v35.31,52.32 | 34.54,47.24 36.83,47.24 v37.08,47.5 | v36.58,28.45 37.85,27.18 | 37.85,27.18 v29.72,27.18 | v43.69,48.01 v46.23,48.01 44.96,49.28 v44.96,50.29 | 37.85,27.18 48.01,27.18 49.02,28.19 v49.02,28.25 49.33,27.94 v59.25,27.94 61.21,27.94 v61.72,28.45 62.23,27.94 v71.95,27.94 73.91,27.94 v74.42,28.45 74.93,27.94 v84.65,27.94 86.61,27.94 v87.12,28.45 | v61.72,66.29 v65.28,66.29 | v65.28,67.31 67.82,67.31 v68.07,67.56 | v68.07,69.85 69.09,69.85 v70.1,70.87 | 71.16,79.52 v71.17,79.5 71.17,75.73 v70.87,75.43 | v87.12,52.58 90.93,52.58 v91.44,52.07 | v89.86,48.77 91.44,48.77
  Bottom 0.508: v164.59,104.65 164.69,104.65 S4.B3 167.89,101.45 v167.89,101.09 | v167.89,92.96 143.51,92.96 143,93.47 69.6,93.47 67.06,90.93 64.52,90.93 | S4.B2 S4.B1 | S3.B2 S3.B1 20.32,107.66 20.32,103.89 21.26,102.95 S3.B3 S3.B4 24.13,102.93 v24.13,96.01 | v25.65,12.7 26.16,12.19 27.69,12.19 v28.19,12.7 | v33.78,55.37 35.94,55.37 v36.58,56.01 | v34.8,75.18 35.81,75.18 37.34,76.71 v38.61,76.71 | v35.05,71.12 35.05,69.6 36.07,68.58 v36.07,65.28 | v52.83,94.49 41.91,94.49 41.15,95.25 v29.97,95.25 29.97,94.23 27.94,92.2 27.94,87.88 v27.69,87.63 | v47.24,4.32 v44.7,4.32 | v52.83,92.71 62.74,92.71 64.52,90.93 | v60.2,4.32 v57.66,4.32 | v63.99,84.09 65.26,84.09 v66.03,83.33 | v64.76,87.14 64.52,87.38 64.52,90.93 | v68.57,82.56 67.82,81.82 67.82,80.01 v68.31,79.52 68.33,79.5 v71.17,79.5 | v72.9,4.32 v70.36,4.32 | v74.42,3.05 v87.12,3.05 | v87.88,12.95 v90.93,12.95 | v91.44,47.24 91.44,48.77 v91.44,52.07 | v94.23,66.8 95.25,67.82 v95.25,69.32
  pour Top (isolate 0.127, rank 2): 0,58.42 25.4,58.42 25.4,49.53 arc-90 34.29,40.64 35.56,40.64 35.56,45.72 52.07,45.72 52.07,73.15 48.01,77.72 25.4,77.72 25.4,73.66 0,73.66
  pour Top (isolate 0.254, rank 2): 28.19,88.14 27.43,88.14 25.4,86.11 25.4,77.72 28.19,77.72
  pour Top (isolate 0.127, rank 2): 2.54,16.26 87.88,16.26 90.42,18.8 90.42,28.45 89.66,29.21 89.66,46.99 90.93,48.26 90.93,66.29 95.5,66.29 95.5,48.26 97.03,46.99 97.03,26.92 95.76,25.65 95.76,17.02 91.19,12.45 2.54,12.45
  pour Top (isolate 0.127): 67.56,77.22 74.17,83.06 78.49,83.06 80.01,81.53 83.82,81.53 83.82,83.57 78.23,89.15 66.29,89.15 63.5,86.36 63.5,77.22
  pour Top (isolate 0.254, rank 2): 27.94,0 27.94,15.24 91.44,15.24 91.44,0
3V3_WATCHDOGGED  (via drill 0.3)
  Top 0.254: R32.B2 34.78,87.99 34.92,88.14 34.92,88.9 | R32.C2 34.82,88.79 34.92,88.9 | 34.92,89.79 34.92,88.9
  Top 0.381: U9.1 28.04,90.58 27.94,90.68
  Bottom 0.508: v29.21,86.61 v29.21,90.68
  pour Top (isolate 0.127, rank 2): 26.67,92.96 26.67,90.42 28.7,88.65 28.7,86.36 35.31,86.36 35.31,93.47 27.18,93.47
5V_UNMETERED  (via drill 0.3)
  Top 0.254: U13.7 15.24,89.41 16.76,87.88 C71.1 | v28.96,50.8 C55.1 28.08,51.96 28.69,52.57 | 28.69,52.57 U6.19 | v29.72,47.5 32.26,44.96 v37.59,44.96 | U16.1 31.8,81.35 C66.1 | 37.83,51.55 37.34,51.05 37.34,49.67 C43.1 37.54,49.47 37.54,48.28 37.85,47.98 v37.85,47.5 | U1.19 37.83,51.55 | 41.68,72.66 U2.19 | 41.68,72.66 42.94,72.66 v43.43,73.15 43.18,73.41 C46.1 43.8,74.03 44.2,74.42 44.2,76.2 42.93,77.47 42.93,79.53 v42.43,80.02 | 47.51,51.8 U5.19 | 47.51,61.2 47.59,61.12 47.59,60.64 48.31,59.92 48.31,59.89 v48.51,59.69 C50.1 | U4.19 47.51,61.2 | 47.51,51.8 47.75,51.56 48.77,51.56 49.64,50.69 C52.1 v48.77,50.55 | U3.19 50.25,71.13 50.31,71.07 50.77,71.07 | 50.77,71.07 51.4,71.07 C48.1 | v50.55,72.64 50.69,72.5 C48.1 | v52.78,71.63 52.78,72.45 C48.1 | v52.83,65.28 v52.83,68.33 | U3.18 50.34,70.63 50.77,71.07 | U2.18 41.18,72.16 41.68,72.66 | U4.18 47.01,61.7 47.51,61.2 | U5.18 47.01,52.3 47.51,51.8 | U1.18 38.33,52.05 37.83,51.55 | U6.18 29.19,53.07 28.69,52.57
  Top 0.381: S18.3 10.37,94.99 9.4,94.02
  Top 0.508: 9.4,96.76 9.4,94.02 9.4,90.03 | 9.4,96.76 9.4,99.57 1.27,107.7 1.27,162.56 13.97,175.26 13.97,186.69 15.24,187.96 21.59,187.96 22.86,186.69 JP16.1 | JP11.1 v166.62,93.73 | v30.73,94.49 v26.42,94.49 | v17.02,92.2 17.27,92.2 17.78,91.69 17.78,84.22 | v14.73,94.49 12.45,96.77 9.41,96.77 9.4,96.76 | v43.18,85.6 43.94,86.36 v43.94,93.73
  Bottom 0.254: v28.96,50.8 29.72,50.04 v29.72,47.5 | v37.59,44.96 37.85,45.21 37.85,46.99 | 37.85,46.99 v37.85,47.5 | v43.18,85.6 41.91,84.33 41.91,80.52 42.4,80.02 v42.43,80.02 | v43.43,73.15 50.04,73.15 v50.55,72.64 | 37.85,46.99 47.5,46.99 48.77,48.26 v48.77,50.55 48.77,57.15 49.28,57.66 | 49.28,57.66 49.28,57.4 49.78,56.9 51.05,56.9 51.56,57.4 51.56,62.71 51.87,63.02 51.87,64.31 v52.83,65.28 | 49.28,57.66 49.28,58.93 v48.51,59.69 | v52.83,68.33 52.83,71.58 v52.78,71.63
  Bottom 0.508: v166.62,93.73 144.02,93.73 143.51,94.23 69.34,94.23 66.8,91.69 64.77,91.69 62.74,93.73 v43.94,93.73 37.34,93.73 36.58,94.49 v30.73,94.49 | v24.64,78.23 v28.7,78.23 | v26.42,94.49 22.35,94.49 19.81,91.95 17.27,91.95 v17.02,92.2 v14.73,94.49
  pour Top (isolate 0.254, rank 4): 8.89,90.68 8.89,87.38 19.05,77.22 19.05,73.66 25.4,73.66 25.4,77.72 34.29,77.72 34.29,85.09 20.32,85.09 14.73,90.68
5V_WATCHDOGGED  (via drill 0.3)
  Top 0.254: 18.29,88.14 18.3,88.13 U10.P1 19.15,88.8 19.05,88.9 | R33.A2 25.69,87.16 26.42,87.88 | R33.B2 25.76,87.99 26.67,88.9 | R33.C2 25.8,88.79 26.42,89.41 26.42,90.17 26.16,90.42 22.35,90.42 21.59,89.66 | R34.A2 42.9,86.84 43.43,87.38 | R34.B2 42.78,87.74 43.43,88.39 43.29,88.54 R34.C2 | 44.7,88.65 44.72,88.63 U12.P1 45.32,89.3 45.21,89.41 | R35.A2 52.1,86.84 52.32,86.61 | R35.B2 52.22,87.74 52.32,87.63 | R35.C2 52.18,88.54 52.32,88.39 | U11.P1 35.83,89.65 35.81,89.66
  Top 0.381: S18.1 13.17,93.51 13.21,93.47
  Top 0.508: v25.91,93.73 v30.73,93.73 | v17.02,91.19 16.51,91.69 16.51,91.74 16.33,91.92 16.33,92.89 15.75,93.47 | R2.2 19.17,90.79 v18.54,90.17
  Bottom 0.508: 18.45,91.19 v17.02,91.19 | 18.45,91.19 20.07,91.19 22.61,93.73 v25.91,93.73 | v51.82,92.96 v45.21,92.96 v43.18,92.96 v36.83,92.96 36.07,93.73 v30.73,93.73 | v18.54,90.17 18.54,91.09 18.45,91.19
  pour Top (isolate 0.254, rank 4): 52.83,86.11 52.83,93.98 12.95,93.98 12.95,93.22 20.07,86.11
!BACKPLANE_RESET  (via drill 0.3, 0.41)
  Top 0.203: 140.21,127.13 U18.4
  Top 0.254: U18.4 140.84,127.12 140.97,127.25 v141.48,127.25 | R42.1 152.15,70.87 153.16,71.88 | 153.16,71.88 v153.16,36.32 | 153.16,71.88 v153.92,72.64 | v168.91,127.25 v172.21,127.25 | v57.4,84.84 57.4,85.34 61.98,89.92 v65.79,89.92 | v57.66,69.34 57.66,68.58 61.21,65.02 v62.99,65.02 | U17.4 71.62,125.72 v71.88,125.98 | v71.63,114.55 71.63,113.54 71.12,113.03 71.12,102.62 72.64,101.09 72.64,95.53 v76.53,91.64 76.73,91.45 U19.4 | v88.14,125.73 87.88,125.98 87.88,147.07 98.81,157.99 98.81,175.01 97.79,176.02 JP14.2 | v62.48,61.72 62.48,61.82 D2.4A
  Bottom 0.254: v141.48,127.25 v168.91,127.25 | J1.22 147.45,30.61 147.45,30.74 147.82,31.11 147.96,31.11 v153.16,36.32 | v153.92,72.64 171.7,72.64 172.47,73.41 172.47,125.98 172.21,126.24 v172.21,127.25 172.21,128.02 172.47,128.27 172.47,166.12 163.07,175.51 113.79,175.51 107.95,181.36 99.31,181.36 JP14.2 | v57.4,84.84 57.4,79.15 56.84,78.59 56.84,78.18 54.86,76.2 54.86,72.16 57.45,69.57 57.45,69.55 v57.66,69.34 | v62.48,61.72 62.99,62.23 v62.99,65.02 | v65.79,89.92 66.8,89.92 68.07,91.19 70.61,91.19 71.12,91.69 75.95,91.69 76,91.64 v76.53,91.64 | v71.63,114.55 78.23,114.55 88.14,124.46 v88.14,125.73 72.14,125.73 v71.88,125.98
!POWER_ON_RESET
  Top 0.254: U32.6 27.31,62.48 U20.1 27.24,61.66 27.94,60.96 27.94,58.93 28.34,58.53 R52.1
!SMBALERT  (via drill 0.3)
  Top 0.254: J1.6 144.02,81.79 146.05,81.79 146.69,81.15 | 146.69,81.15 146.94,81.15 147.57,81.79 148.84,81.79 149.3,81.33 v149.3,79.5 | 146.81,81.03 146.69,81.15 | v156.21,99.06 156.21,91.19 161.8,85.6 v161.8,82.04 | R45.1 v159.77,71.63 159.77,77.72 v158.75,78.74 | JP11.10 v169.16,71.63 | U22.17 41.9,82.28 42.42,82.8 47.24,82.8 49.53,85.09 53.85,85.09 63.5,94.74 64.77,94.74 66.04,96.01 v66.04,99.06 v66.04,114.25 | v41.91,114.3 41.91,128.52 41.66,128.78 41.66,166.62 50.55,175.51 71.37,175.51 JP12.6
  Bottom 0.254: v149.3,79.5 149.35,79.5 150.11,78.74 v158.75,78.74 159.77,78.74 161.8,80.77 v161.8,82.04 | v156.21,99.06 v66.04,99.06 | v169.16,71.63 v159.77,71.63 | v41.91,114.3 52.55,114.3 52.6,114.35 53.06,114.35 53.11,114.3 65.99,114.3 v66.04,114.25
!WATCHDOG  (via drill 0.3, 0.41)
  Top 0.254: v111.63,49.43 110.72,48.51 90.42,48.51 89.7,47.79 89.7,47.76 89.37,47.43 U15.6 | v113.59,51.44 113.72,51.56 119.63,51.56 v120.4,50.8 | v137.67,67.31 v137.67,49.78 | v141.48,76.66 141.48,82.04 J1.7 | v150.89,76.69 151.38,77.19 151.38,83.57 153.92,86.11 153.92,107.7 165.1,118.87 165.1,168.4 v165.61,168.91
  Bottom 0.254: v111.63,49.43 111.63,49.48 v113.59,51.44 | v120.4,50.8 121.41,49.78 v137.67,49.78 | v137.67,67.31 137.67,74.93 139.4,76.66 v141.48,76.66 150.6,76.66 150.64,76.69 v150.89,76.69 | v165.61,168.91 161.54,172.97 112.52,172.97 106.68,178.82 96.01,178.82 95.25,179.58 78.49,179.58 77.47,180.59 77.47,184.15 JP12.7
CONT0_!RESET  (via drill 0.3)
  Top 0.254: v102.11,17.27 104.14,17.27 106.81,14.61 J1.105 | v43.18,96.52 42.67,97.03 42.67,112.52 40.64,114.55 40.64,167.13 55.88,182.37 55.88,184.15 JP9.1 | v55.37,96.01 v55.37,89.15 | v58.17,65.02 56.9,66.29 v56.9,67.31 | 58.69,26.42 57.66,26.42 55.88,28.19 55.88,33.78 62.99,40.89 v62.99,45.47 | v58.42,61.72 58.37,61.78 D1.3A | 58.69,26.42 58.69,23.84 S10.4 S10.3 63.66,20.41 v64.26,19.81 | 58.69,26.42 S21.9 | v92.25,19.81 v94.49,19.81 | v97.03,17.27 v99.82,17.27
  Bottom 0.254: v102.11,17.27 v99.82,17.27 | v43.18,96.52 43.69,96.01 45.69,96.01 45.74,95.96 46.2,95.96 46.26,96.01 v55.37,96.01 | v56.9,67.31 55.34,68.86 55.34,69.31 53.34,71.32 53.34,77.72 56.13,80.52 56.13,88.39 v55.37,89.15 | v58.17,65.02 58.42,64.77 v58.42,61.72 58.62,61.52 58.62,61.49 62.99,57.12 v62.99,45.47 | v64.26,19.81 v92.25,19.81 | v94.49,19.81 v97.03,17.27
CONT0_DBG_GPIO1  (via drill 0.3)
  Top 0.254: v118.62,1.07 118.57,1.02 60.71,1.02 59.18,2.54 59.18,2.79 | v17.53,65.41 17.32,65.61 17.32,65.64 1.52,81.44 1.52,93.22 v6.86,98.55 | v17.53,61.59 17.53,50.55 25.91,42.16 25.91,20.57 v26.42,20.07 | v9.14,114.81 19.81,125.48 v33.27,125.48 | v26.42,15.49 26.42,3.3 28.7,1.02 56.9,1.02 v57.91,2.03 | v38.86,126.75 39.12,127 39.12,172.21 52.07,185.17 JP9.5 | R73.2 Q4.G1 59.8,18.43 60.2,18.03 60.2,16.51 59.18,15.49 59.18,2.79 | 59.18,2.79 59.44,2.54 v60.2,2.54
  Bottom 0.254: v118.62,1.07 118.62,9.4 J1.101 | v17.53,65.41 v17.53,61.59 | v26.42,20.07 v26.42,15.49 | v33.27,125.48 37.34,125.48 38.61,126.75 v38.86,126.75 | v57.91,2.03 59.69,2.03 v60.2,2.54 | v6.86,98.55 9.14,100.84 v9.14,114.81
CONT0_DBG_GPIO2  (via drill 0.3)
  Top 0.254: v120.14,0.56 120.09,0.51 60.45,0.51 | v120.14,8.38 120.14,13.46 J1.104 | v18.29,65.41 18.09,65.61 18.09,65.64 2.03,81.69 2.03,92.71 v6.86,97.54 | v18.29,61.59 18.29,50.55 26.42,42.42 26.42,20.86 26.98,20.3 26.98,20.27 v27.18,20.07 | v10.16,114.81 20.07,124.71 v33.27,124.71 | v27.18,15.49 27.18,3.56 v28.96,1.78 | v27.94,0.76 28.19,0.51 60.45,0.51 | v41.35,128.02 41.15,128.22 41.15,166.88 JP9.2 | R74.2 55.48,18.43 55.88,18.03 55.88,16.51 56.64,15.75 58.67,15.75 | 58.67,15.75 58.67,2.29 60.45,0.51 | 58.67,15.75 59.25,16.32 Q4.G2
  Bottom 0.254: v6.86,97.54 10.16,100.84 v10.16,114.81 | v120.14,8.38 v120.14,0.56 | v18.29,65.41 v18.29,61.59 | v27.18,20.07 v27.18,15.49 | v28.96,1.78 v27.94,0.76 | v33.27,124.71 37.85,124.71 41.15,128.02 v41.35,128.02
CONT0_DBG_RX  (via drill 0.3)
  Top 0.254: v41.66,95.76 41.66,112.01 39.62,114.05 39.62,171.96 51.82,184.15 53.34,184.15 JP9.3 | U4.30 51.07,65.27 52.32,64.01 | v52.32,62.48 52.32,64.01 | 52.32,64.01 56.64,59.69 v56.64,50.29 | v53.85,64.26 53.85,69.34 54.36,69.85 54.36,70.61 53.85,71.12 53.85,74.42 52.32,75.95 52.32,81.28 v53.85,82.8 | v53.85,94.74 v53.85,87.63 | v91.69,44.2 v95.76,44.2
  Bottom 0.254: J1.103 120.14,13.46 121.92,13.46 122.68,14.22 122.68,17.53 121.16,19.05 113.28,19.05 107.44,24.89 107.44,32.77 96.01,44.2 v95.76,44.2 | v41.66,95.76 42.42,95 52.55,95 52.6,95.05 53.54,95.05 v53.85,94.74 | v52.32,62.48 52.32,62.74 v53.85,64.26 | v53.85,87.63 v53.85,82.8 | v56.64,50.29 56.64,50.04 56.9,49.78 56.9,45.97 59.18,43.69 91.19,43.69 v91.69,44.2
CONT0_DBG_TX  (via drill 0.3)
  Top 0.254: v42.42,96.27 42.16,96.52 42.16,112.27 40.13,114.3 40.13,168.4 JP9.4 | U4.2 49.51,67.57 50.06,68.12 51.26,68.12 52.07,67.31 52.07,65.02 54.36,62.74 | 54.36,62.74 57.15,59.94 57.15,50.57 57.2,50.52 57.2,50.49 v57.4,50.29 | 54.36,62.74 54.36,63.98 54.41,64.03 54.41,64.49 54.36,64.54 54.36,69.09 54.86,69.6 54.86,70.87 54.36,71.37 54.36,74.68 52.83,76.2 52.83,80.77 54.61,82.55 v54.61,82.8 | v54.61,95.25 v54.61,88.39 | v91.69,44.96 v95.76,44.96
  Bottom 0.254: J1.102 123.19,13.97 123.19,17.78 121.41,19.56 113.54,19.56 107.95,25.15 107.95,33.02 96.01,44.96 v95.76,44.96 | v42.42,96.27 43.18,95.5 54.36,95.5 v54.61,95.25 | v54.61,88.39 v54.61,82.8 | v57.4,50.29 57.4,46.23 59.44,44.2 90.68,44.2 91.44,44.96 v91.69,44.96
CONT0_SWDCLK  (via drill 0.3)
  Top 0.254: v103.12,21.34 106.17,18.29 120.14,18.29 J1.106 | S21.3 60.19,35.55 v61.72,37.08 | v91.48,33.32 95.72,33.32 v96.27,32.77
  Bottom 0.254: v103.12,21.34 100.58,23.88 100.58,28.45 v96.27,32.77 | v61.72,37.08 75.44,37.08 75.95,37.59 87.21,37.59 v91.48,33.32
CONT0_SWDIO  (via drill 0.3)
  Top 0.254: v103.12,19.81 105.79,17.14 106.43,17.14 | 106.43,17.14 106.3,17.14 | J1.107 106.43,17.14 | S21.2 60.69,34.83 v62.23,36.37 | v91.47,32.54 95.48,32.54 v96.27,31.75
  Bottom 0.254: v62.23,36.37 75.49,36.37 76.2,37.08 86.92,37.08 v91.47,32.54 | v96.27,31.75 99.82,28.19 99.82,23.11 v103.12,19.81
CONT0_VCCIO
  Top 0.254: C49.1 45.47,59.8 45.47,62.48 45.75,62.77 U4.16
CONT1_!RESET  (via drill 0.3, 0.41)
  Top 0.254: v102.11,16.51 104.14,16.51 113.03,7.62 148.08,7.62 149.56,9.09 v149.56,12.45 | JP10.1 134.87,186.94 158.24,186.94 159.26,185.93 159.26,180.09 163.07,176.28 166.37,176.28 173.74,168.91 173.74,72.9 163.07,62.23 v162.56,62.23 | J1.205 152.02,14.61 153.16,15.75 159.51,15.75 161.8,18.03 161.8,60.96 v161.54,61.21 | D1.4A 58.77,62.2 59.01,61.95 59.01,61.9 v59.18,61.72 | v63.75,45.47 63.75,41.15 68.58,36.32 68.58,28.45 70.1,26.92 71.37,26.92 | 71.37,26.92 71.37,23.82 S11.4 S11.3 76.36,19.6 v76.71,19.25 | 71.37,26.92 71.37,28.19 71.39,28.21 S22.9 | v92.25,19.05 v94.23,19.05 | v96.77,16.51 v99.82,16.51
  Bottom 0.254: v102.11,16.51 v99.82,16.51 | v149.56,12.45 149.61,12.45 J1.205 | v162.56,62.23 v161.54,61.21 | v63.75,45.47 63.75,57.15 v59.18,61.72 | v76.71,19.25 77.01,19.25 77.22,19.05 v92.25,19.05 | v94.23,19.05 v96.77,16.51
CONT1_DBG_GPIO1  (via drill 0.3)
  Top 0.254: JP10.5 131.32,188.47 159,188.47 160.78,186.69 160.78,180.85 163.83,177.8 167.13,177.8 175.26,169.67 175.26,72.14 164.59,61.47 164.59,60.45 164.34,60.2 v164.34,7.87 | v155.96,7.87 153.42,7.87 J1.201 151.76,9.02 144.78,2.03 73.41,2.03 71.88,3.56 71.88,15.75 72.9,16.76 72.9,18.03 72.5,18.43 Q5.G1 R75.2
  Bottom 0.254: v155.96,7.87 v164.34,7.87
CONT1_DBG_GPIO2  (via drill 0.3, 0.41)
  Top 0.254: JP10.2 136.91,186.44 157.99,186.44 158.75,185.67 158.75,179.83 162.81,175.77 166.12,175.77 173.23,168.66 173.23,118.11 172.47,117.35 v169.67,117.35 | v150.62,6.6 145.54,1.52 118.95,1.52 118.85,1.63 118.39,1.63 118.28,1.52 73.15,1.52 71.37,3.3 71.37,16 | J1.204 159.13,14.61 162.31,17.78 162.31,61.47 161.8,61.98 161.8,62.48 162.31,62.99 163.07,62.99 173.23,73.15 173.23,99.57 171.45,101.35 v169.67,101.35 | R76.2 68.21,17.13 69.34,16 71.37,16 | 71.37,16 71.95,16.58 Q5.G2
  Bottom 0.254: v150.62,6.6 150.62,12.7 151.38,13.46 153.16,13.46 J1.204 | v169.67,101.35 169.93,101.6 169.93,117.09 v169.67,117.35
CONT1_DBG_RX  (via drill 0.3, 0.41)
  Top 0.254: v109.47,9.91 112.78,6.6 v124.97,6.6 | JP10.3 133.35,187.96 158.75,187.96 160.27,186.44 160.27,180.59 163.58,177.29 166.88,177.29 174.75,169.42 174.75,72.39 163.83,61.47 v163.83,60.96 | v147.07,1.73 147.27,1.73 v151.89,6.35 | J1.203 152.02,12.06 153.16,13.21 158.5,13.21 163.32,18.03 163.32,59.18 v163.07,59.44 | U5.30 51.32,55.87 52.58,54.61 52.58,51 v52.78,50.8 | v91.95,37.08 v95.76,37.08
  Bottom 0.254: v109.47,9.91 108.46,9.91 103.89,14.48 103.89,28.96 v95.76,37.08 | v124.97,6.6 129.79,1.78 147.01,1.78 v147.07,1.73 | J1.203 152.78,11.05 152.78,9.1 152.65,8.98 152.65,7.11 v151.89,6.35 | v163.07,59.44 163.83,60.2 v163.83,60.96 | v52.78,50.8 52.78,50.75 52.58,50.55 52.58,44.96 52.78,44.76 52.78,44.73 59.87,37.64 61.95,37.64 62,37.59 75.18,37.59 75.69,38.1 90.93,38.1 v91.95,37.08
CONT1_DBG_TX  (via drill 0.3)
  Top 0.254: v108.71,10.67 108.71,9.65 112.27,6.1 124.46,6.1 124.51,6.04 v124.46,6.04 | JP10.4 132.08,184.15 132.08,185.67 133.86,187.45 158.5,187.45 159.77,186.18 159.77,180.34 163.32,176.78 166.62,176.78 174.24,169.16 174.24,72.64 163.07,61.47 163.07,60.71 163.83,59.94 163.83,17.78 158.12,12.06 J1.202 | v147.61,1.23 147.79,1.23 v152.91,6.35 | U5.2 49.51,57.89 49.7,57.89 50.03,58.22 51.03,58.22 51.36,57.89 51.36,57.86 53.34,55.88 53.34,50.29 v53.27,50.23 | v91.96,37.86 95.74,37.86 v95.76,37.85
  Bottom 0.254: v108.71,10.67 108.46,10.67 104.39,14.73 104.39,29.24 95.99,37.64 95.96,37.64 v95.76,37.85 | v124.46,6.04 129.24,1.27 146.56,1.27 146.81,1.02 147.4,1.02 v147.61,1.23 | v152.91,6.35 152.91,6.83 153.03,6.95 153.03,6.99 153.16,7.11 153.16,10.92 J1.202 | v53.27,50.23 53.27,45.02 59.93,38.37 62.02,38.37 62.28,38.1 74.93,38.1 75.44,38.61 91.21,38.61 v91.96,37.86
CONT1_SWDCLK  (via drill 0.3)
  Top 0.254: v103.89,7.62 106.43,5.08 146.3,5.08 150.11,8.89 150.11,17.02 151.38,18.29 153.16,18.29 J1.206 | S22.3 72.89,33.01 76.2,36.32 76.68,36.32 v76.71,36.35 | v91.45,31.76 95.01,31.76 v95.77,31
  Bottom 0.254: v76.71,36.35 86.87,36.35 v91.45,31.76 | v95.77,31 96.32,30.46 96.32,30.43 99.06,27.69 99.06,12.45 v103.89,7.62
CONT1_SWDIO  (via drill 0.3)
  Top 0.254: v103.89,6.6 105.92,4.57 146.56,4.57 150.62,8.64 150.62,16 J1.207 | S22.2 73.39,32.75 76.2,35.56 76.66,35.56 v76.71,35.61 | v91.44,30.99 95,30.99 v95.76,30.23
  Bottom 0.254: v76.71,35.61 86.82,35.61 v91.44,30.99 | v95.76,30.23 98.55,27.43 98.55,11.94 v103.89,6.6
CONT1_VCCIO
  Top 0.254: C51.1 45.21,51.42 45.21,53.09 45.49,53.37 U5.16
CONT_DBG_PIN1
  Bottom 0.254: JP20.1 100.58,183.9 100.58,185.93 104.39,189.74 171.2,189.74 174.24,186.69 174.24,180.09 182.12,172.21 182.12,8.89 175.51,2.29 133.6,2.29 125.09,10.79 JP19.1
CONT_DBG_PIN2
  Bottom 0.254: JP20.2 105.41,189.23 170.94,189.23 173.74,186.44 173.74,179.83 181.61,171.96 181.61,9.14 175.26,2.79 133.86,2.79 126.24,10.41 126.24,14.22 125.22,15.24 JP19.2
CONT_DBG_PIN3
  Bottom 0.254: JP20.3 103.12,183.9 103.12,185.93 105.92,188.72 170.69,188.72 171.7,187.71 171.7,181.1 181.1,171.7 181.1,9.4 175.01,3.3 134.11,3.3 127.64,9.78 JP19.3
CONT_DBG_PIN4
  Bottom 0.254: JP20.4 106.93,188.21 170.43,188.21 171.2,187.45 171.2,180.85 180.59,171.45 180.59,9.65 174.75,3.81 134.37,3.81 128.78,9.4 128.78,14.22 127.76,15.24 JP19.4
CONT_DBG_PIN5
  Bottom 0.254: JP20.5 105.66,183.9 105.66,185.93 107.44,187.71 167.89,187.71 169.16,186.44 169.16,182.12 180.09,171.2 180.09,9.91 174.5,4.32 134.62,4.32 130.18,8.76 JP19.5
CONT_DBG_PIN6
  Bottom 0.254: JP20.6 108.46,187.2 167.64,187.2 168.66,186.18 168.66,181.86 179.58,170.94 179.58,10.16 174.24,4.83 134.87,4.83 131.32,8.38 131.32,14.22 130.3,15.24 JP19.6
CONT_DBG_PIN7
  Bottom 0.254: JP20.7 110.49,184.15 110.49,185.93 111.25,186.69 166.12,186.69 166.62,186.18 166.62,181.86 179.07,169.42 179.07,10.41 173.99,5.33 135.13,5.33 132.72,7.75 JP19.7
CONT_DBG_PIN8
  Bottom 0.254: JP20.8 107.95,184.15 107.95,182.12 114.05,176.02 163.32,176.02 172.97,166.37 172.97,54.36 135.64,17.02 134.49,17.02 JP19.8 132.84,15.24
CONT_DBG_PIN9
  Bottom 0.254: JP20.9 111.76,181.86 116.59,177.04 163.83,177.04 173.99,166.88 173.99,53.85 136.65,16.51 136.65,13.97 135.38,12.7 JP19.9
CONT_DBG_PIN10
  Bottom 0.254: JP20.10 111.76,184.66 110.49,183.39 110.49,181.86 115.82,176.53 163.58,176.53 173.48,166.62 173.48,54.1 135.25,15.88 JP19.10 135.38,15.24
CONT_DBG_PIN11
  Bottom 0.254: JP20.11 114.3,182.12 118.36,178.05 164.34,178.05 175.01,167.39 175.01,53.34 139.19,17.53 139.19,16 | JP19.11 137.92,12.7 139.19,13.97 139.19,16 | 139.19,16 139.19,16.51
CONT_DBG_PIN12
  Bottom 0.254: JP20.12 113.03,184.15 113.03,181.36 116.84,177.55 164.08,177.55 174.5,167.13 174.5,53.59 137.79,16.89 137.79,15.75 | 137.79,15.75 JP19.12 137.92,15.24 | 137.79,15.75 137.79,16.38
CONT_DBG_PIN13
  Bottom 0.254: JP20.13 116.84,182.63 120.4,179.07 164.85,179.07 176.02,167.89 176.02,52.83 141.73,18.54 141.73,16.26 | JP19.13 140.34,12.83 141.73,14.22 141.73,16.26 | 141.73,16.26 141.73,17.02
CONT_DBG_PIN14
  Bottom 0.254: JP20.14 115.57,184.15 115.57,182.12 119.13,178.56 164.59,178.56 175.51,167.64 175.51,53.09 140.34,17.91 140.34,16.26 | 140.34,16.26 JP19.14 | 140.34,16.26 140.34,16.64
CONT_DBG_PIN15
  Bottom 0.254: JP20.15 122.17,180.09 165.35,180.09 177.04,168.4 177.04,52.32 144.02,19.3 144.02,17.27 | JP19.15 142.88,12.83 144.02,13.97 144.02,17.27 | 144.02,17.27 144.02,17.53
CONT_DBG_PIN16
  Bottom 0.254: JP20.16 118.11,184.15 118.11,182.37 120.9,179.58 165.1,179.58 176.53,168.15 176.53,52.58 142.88,18.92 JP19.16
CONT_DBG_PIN18
  Bottom 0.254: JP20.18 120.65,184.15 120.65,182.37 122.43,180.59 165.61,180.59 177.55,168.66 177.55,52.07 145.41,19.94 145.41,17.78 | 145.41,17.78 JP19.18 | 145.41,17.78 145.41,18.16
CONT_DBG_PIN20
  Bottom 0.254: JP20.20 125.98,183.9 125.98,183.13 127.51,181.61 166.12,181.61 178.56,169.16 178.56,51.56 160.02,33.02 160.02,32.26 159.26,31.5 158.5,31.5 147.96,20.95 JP19.20
CONT_HDR_BOT_RSV_PIN6  (via drill 0.41)
  Top 0.254: v148.08,30.48 143.26,30.48 | v161.04,43.69 161.29,43.94 161.29,59.94 160.53,60.71 160.53,61.98 162.05,63.5 162.81,63.5 172.72,73.41 172.72,99.06 171.2,100.58 v170.18,100.58
  Bottom 0.254: v148.08,30.48 148.34,30.48 161.04,43.18 v161.04,43.69 | v170.18,100.58 170.43,100.84 170.43,124.97 169.93,125.48 169.93,129.03 170.43,129.54 170.43,165.1 162.05,173.48 112.78,173.48 106.93,179.32 96.27,179.32 JP14.6
CONT_HDR_BOT_RSV_PIN9  (via drill 0.3, 0.41)
  Top 0.254: 131.57,27.43 130.05,25.91 130.05,24.13 134.11,20.07 v158.75,20.07 | v168.91,25.4 181.86,38.35 181.86,172.97 177.04,177.8 177.04,186.18 173.74,189.48 91.44,189.48 87.63,185.67 JP13.1